# Altium project Motion_Controller.PrjPCB (part 3 of 4)

## Sheet POWER.SchDoc: Power Supply
size 420 x 297 mm; EDA_Number: ARTIQ; Projet: HVPSU_ISOL; Author: G.Kasprowicz; CompanyName: WUT ISE; DrawnBy: G.Kasprowicz; Organization: WUT ISE; Address1: PW ISE; Address2: Nowowiejska 15/19 00-665 Warsaw; Address3: gkasprow@gmail.com; DocumentNumber: 7; Revision: 2; SheetNumber: 7; SheetTotal: 10; ModifiedBy: -; CheckedDate: -; DivGrp: WUT ISE; Designer: G.Kasprowicz; ModifiedDate: -; ProjectName: Sensor Box
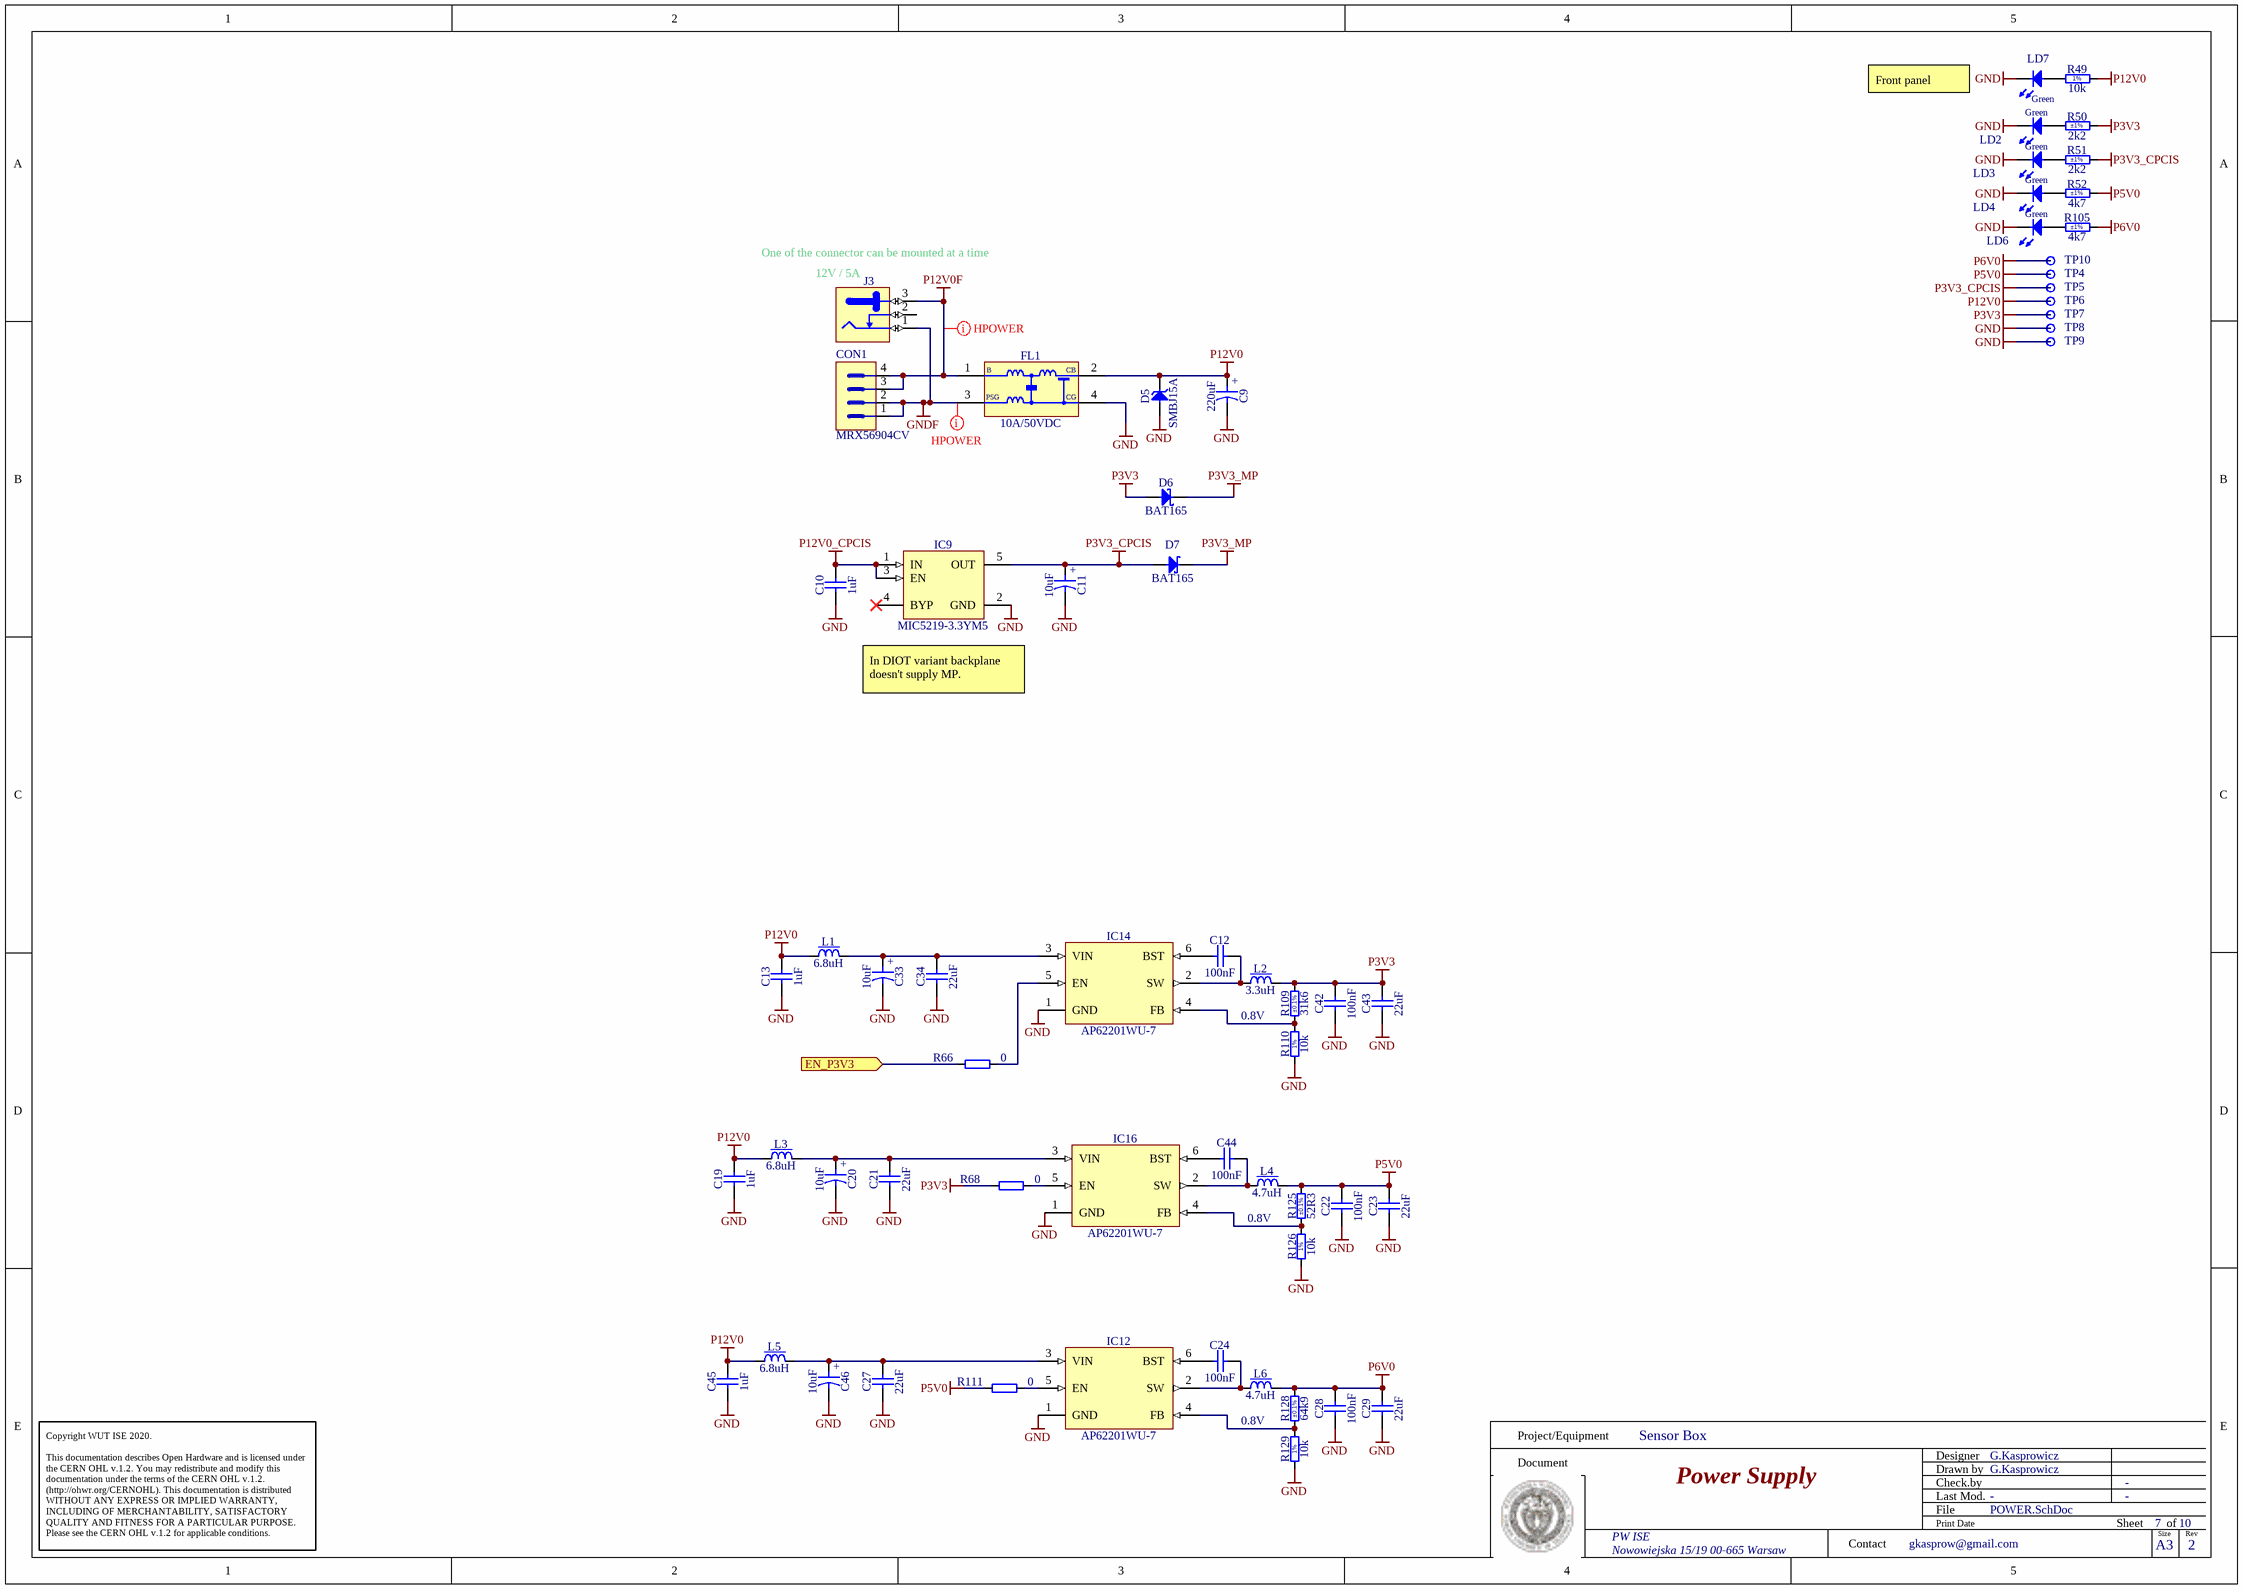
[diagram p6: POWER.SchDoc]

### Parts
C9  220uF  [CAPAE830X620N]
C10  1uF  [CAPC1608X87N]
C11  10uF  [CAPMP3216X180N]
C12  100nF  [CAPC1005X55N]
C13  1uF  [CAPC1608X87N]
C19  1uF  [CAPC1608X87N]
C20  10uF  [CAPMP3216X180N]
C21  22uF  [CAPC2012X135N]
C22  100nF  [CAPC1005X55N]
C23  22uF  [CAPC2012X135N]
C24  100nF  [CAPC1005X55N]
C27  22uF  [CAPC2012X135N]
C28  100nF  [CAPC1005X55N]
C29  22uF  [CAPC2012X135N]
C33  10uF  [CAPMP3216X180N]
C34  22uF  [CAPC2012X135N]
C42  100nF  [CAPC1005X55N]
C43  22uF  [CAPC2012X135N]
C44  100nF  [CAPC1005X55N]
C45  1uF  [CAPC1608X87N]
C46  10uF  [CAPMP3216X180N]
CON1  MRX56904CV  [MRX56904CV]
D5  SMBJ15A  [DIOM5336X265N]
D6  BAT165  [SOD2512X110N]
D7  BAT165  [SOD2512X110N]
FL1  10A/50VDC  [FIL_MURATA_BNX02]
IC9  MIC5219-3.3YM5  [SOT95P280X145-5N]
IC12  AP62201WU-7  [SOT95P280X100-6N]
IC14  AP62201WU-7  [SOT95P280X100-6N]
IC16  AP62201WU-7  [SOT95P280X100-6N]
J3  Jack  [SWITCHCRAFT_L712RA]  (value not drawn)
L1  6.8uH  [IND_COILCRAFT_XAL4030]
L2  3.3uH  [IND_WURTH_WE-TPC_4828]
L3  6.8uH  [IND_COILCRAFT_XAL4030]
L4  4.7uH  [IND_WURTH_WE-SPC-4838]
L5  6.8uH  [IND_COILCRAFT_XAL4030]
L6  4.7uH  [IND_WURTH_WE-SPC-4838]
LD2  Green  [LED_KINGBRIGHT_KPH-1608CGCK]
LD3  Green  [LED_KINGBRIGHT_KPH-1608CGCK]
LD4  Green  [LED_KINGBRIGHT_KPH-1608CGCK]
LD6  Green  [LED_KINGBRIGHT_KPH-1608CGCK]
LD7  Green  [LED_DIALIGHT_555-230]
R49  10k  [RESC1005X40N]
R50  2k2  Tolerance: ±1%  [RESC1005X40N]
R51  2k2  Tolerance: ±1%  [RESC1005X40N]
R52  4k7  Tolerance: ±1%  [RESC1005X40N]
R66  0  [RESC1005X40N]
R68  0  [RESC1005X40N]
R105  4k7  Tolerance: ±1%  [RESC1005X40N]
R109  31k6  Tolerance: ±0.1%  [RESC1005X35N]
R110  10k  [RESC1005X40N]
R111  0  [RESC1005X40N]
R125  52R3  Tolerance: ±0.1%  [RESC1608X55N]
R126  10k  [RESC1005X40N]
R128  64k9  Tolerance: ±0.1%  [RESC1005X40N]
R129  10k  [RESC1005X40N]
TP4  Plated Hole  [c150h100]  (value not drawn)  (no BOM)
TP5  Plated Hole  [c150h100]  (value not drawn)  (no BOM)
TP6  Plated Hole  [c150h100]  (value not drawn)  (no BOM)
TP7  Plated Hole  [c150h100]  (value not drawn)  (no BOM)
TP8  Plated Hole  [c150h100]  (value not drawn)  (no BOM)
TP9  Plated Hole  [c150h100]  (value not drawn)  (no BOM)
TP10  Plated Hole  [c150h100]  (value not drawn)  (no BOM)

### Ports
EN_P3V3 (in)

### Nets
GND: C9.2 C10.1 C11.2 C13.1 C19.1 C20.2 C21.1 C22.1 C23.1 C27.1 C28.1 C29.1 C33.2 C34.1 C42.1 C43.1 C45.1 C46.2 D5.2(A) FL1.4(CG) IC9.2(GND) IC12.1(GND) IC14.1(GND) IC16.1(GND) LD2.1(C) LD3.1(C) LD4.1(C) LD6.1(C) LD7.1(C) R110.1 R126.1 R129.1 TP8.1 TP9.1
GNDF: CON1.1 CON1.2 FL1.3(PSG) J3.1
P3V3: C42.2 C43.2 D6.2(A) L2.2 R50.2 R68.1 R109.2 TP7.1
P3V3_CPCIS: C11.1 D7.2(A) IC9.5(OUT) R51.2 TP5.1
P3V3_MP: D6.1(C) D7.1(C)
P5V0: C22.2 C23.2 L4.2 R52.2 R111.1 R125.2 TP4.1
P6V0: C28.2 C29.2 L6.2 R105.2 R128.2 TP10.1
P12V0: C9.1 C13.2 C19.2 C45.2 D5.1(C) FL1.2(CB) L1.1 L3.1 L5.1 R49.2 TP6.1
P12V0_CPCIS: C10.2 IC9.1(IN) IC9.3(EN)
P12V0F: CON1.3 CON1.4 FL1.1(B) J3.3
EN_P3V3: R66.1 ; port EN_P3V3
NetC12_1: C12.1 IC14.6(BST)
NetC12_2: C12.2 IC14.2(SW) L2.1
NetC20_1: C20.1 C21.2 IC16.3(VIN) L3.2
NetC24_1: C24.1 IC12.6(BST)
NetC24_2: C24.2 IC12.2(SW) L6.1
NetC27_2: C27.2 C46.1 IC12.3(VIN) L5.2
NetC33_1: C33.1 C34.2 IC14.3(VIN) L1.2
NetC44_1: C44.1 IC16.6(BST)
NetC44_2: C44.2 IC16.2(SW) L4.1
NetIC12_4: IC12.4(FB) R128.1 R129.2
NetIC12_5: IC12.5(EN) R111.2
NetIC14_4: IC14.4(FB) R109.1 R110.2
NetIC14_5: IC14.5(EN) R66.2
NetIC16_4: IC16.4(FB) R125.1 R126.2
NetIC16_5: IC16.5(EN) R68.2
NetLD2_2: LD2.2(A) R50.1
NetLD3_2: LD3.2(A) R51.1
NetLD4_2: LD4.2(A) R52.1
NetLD6_2: LD6.2(A) R105.1
NetLD7_2: LD7.2(A) R49.1

Not connected (* = marked no-connect by the designer): IC9 4(BYP)*; J3 2

### Layout directives
net class Hpower; rule Routing Via Style [Pref Size = 0.7mm    Pref Hole Size = 0.5mm]; rule Width Constraint [Pref Width = 20mil    Min Width = 15mil    Max Width = 50mil]: GNDF, P12V0F

### Notes on the sheet
- Front panel
- (near J3) One of the connector can be mounted at a time
- (near J3) 12V / 5A
- In DIOT variant backplane doesn't supply MP.
- 0.8V
- Project/Equipment
- Document
- Designer
- Drawn by
- Check.by
- Copyright WUT ISE 2020.
  This documentation describes Open Hardware and is licensed under the CERN OHL v.1.2. You may redistribute and modify this documentation under the terms of the CERN OHL v.1.2. (http://ohwr.org/CERNOHL). This documentation is distributed WITHOUT ANY EXPRESS OR IMPLIED WARRANTY, INCLUDING OF MERCHANTABILITY, SATISFACTORY QUALITY AND FITNESS FOR A PARTICULAR PURPOSE. Please see the CERN OHL v.1.2 for applicable conditions.
- Contact
- File
- Last Mod.
- Print Date
- Sheet
- Size
- A3
- of
- Rev
- (in symbol CAE830-620_220UF_16V_20%) +
- (in symbol CTE3216-18_10UF_16V_20%_AVX_TCJ) +
- (in symbol R0402_10K_1%_0.0625W_100PPM) 1%

### Library data of the parts
C9 = CAE830-620_220UF_16V_20%: Polarised capacitor; Part Description: Aluminum Electrolytic SMT Capacitor; Manufacturer: PANASONIC; Manufacturer Part Number: EEEFK1C221AP; Voltage: 16V; Tolerance: ±20%; Part Number: CAE830-620_220UF_16V_20%; Component Kind: Standard; Component Type: Standard; Pin Count: 2; Value: 220uF; Status: Not Recommended; Case: E; Mounted: Yes; Socket: No; SMD: Yes; Sense: No; ComponentHeight: 6.2mm; HelpURL: \\cern.ch\dfs\Applications\Altium\Datasheets\CAE_PANASONIC_FK.pdf; Author: CERN DEM JLC; CreateDate: 03.12.2007; LatestRevisionDate: 05.11.2014
C10 C13 C19 C45 = CC0603_1UF_25V_10%_X7R: Non-polarised capacitor; Part Description: SMD Multilayer Chip Ceramic Capacitor; Manufacturer: GENERIC; Manufacturer1 Part Number: GRM188R71E105KA12D; Voltage: 25V; TC: X7R; Tolerance: ±10%; Part Number: CC0603_1UF_25V_10%_X7R; Component Kind: Standard; Component Type: Standard; Pin Count: 2; Value: 1uF; Status: None; Manufacturer Part Number: CC0603_1UF_25V_10%_X7R; Case: 0603; Mounted: Yes; Socket: No; SMD: Yes; Sense: No; Manufacturer1 Example: MURATA; Manufacturer1 ComponentHeight: 0.9mm; HelpURL: \\cern.ch\dfs\Applications\Altium\Datasheets\CC0603_X7R_MURATA.pdf; Author: CERN DEM JLC; CreateDate: 18.01.2011; LatestRevisionDate: 18.01.2011
C11 C20 C33 C46 = CTE3216-18_10UF_16V_20%_AVX_TCJ: Polarised capacitor; Part Description: ESR 0R200 Tantalum Solid Electrolytic Chip Capacitor with Conductive Polymer Electrode; Manufacturer: AVX; Manufacturer Part Number: TCJA106M016R0200 or  or TR3A106K016C1700; Voltage: 16V; Tolerance: ±20%; Part Number: CTE3216-18_10UF_16V_20%_AVX_TCJ; Component Kind: Standard; Component Type: Standard; Pin Count: 2; Value: 10uF; Status: Preferred; Case: A; Mounted: Yes; Socket: No; SMD: Yes; Sense: No; ComponentHeight: 1.8mm; HelpURL: \\cern.ch\dfs\Applications\Altium\Datasheets\CTE_AVX_TCJ.pdf; Author: CERN DEM JLC; CreateDate: 29.03.2012; LatestRevisionDate: 29.03.2012
C12 C22 C24 C28 C42 C44 = CC0402_100NF_16V_10%_X5R: as C37 on sheet DAC_TLV5637; Part Number: CC0402_100NF_16V_10%_X5R; Component Kind: Standard; Component Type: Standard; Pin Count: 2; Value: 100nF; Status: None; Manufacturer Part Number: CC0402_100NF_16V_10%_X5R; Case: 0402; Mounted: Yes; Socket: No; SMD: Yes; Sense: No; Manufacturer1 Example: MURATA; Manufacturer1 ComponentHeight: 0.55mm; HelpURL: \\cern.ch\dfs\Applications\Altium\Datasheets\CC0402_X5R_MURATA_GRM.pdf; Author: CERN DEM JLC; CreateDate: 10.12.2013; LatestRevisionDate: 10.12.2013
C21 C23 C27 C29 C34 C43 = CC0805_22UF_16V_10%_X5R: Non-polarised capacitor; Part Description: SMD Multilayer Chip Ceramic Capacitor; Manufacturer: GENERIC; Manufacturer1 Part Number: C2012X5R1C226KT; Voltage: 16V; TC: X5R; Tolerance: ±10%; Part Number: CC0805_22UF_16V_10%_X5R; Component Kind: Standard; Component Type: Standard; Pin Count: 2; Value: 22uF; Status: Preferred; Manufacturer Part Number: CC0805_22UF_16V_10%_X5R; Case: 0805; Mounted: Yes; Socket: No; SMD: Yes; Sense: No; Manufacturer1 Example: TDK; Manufacturer1 ComponentHeight: 1.35mm; HelpURL: \\cern.ch\dfs\Applications\Altium\Datasheets\CC0805_X5R_TDK_C.pdf; Author: CERN DEM JLC; CreateDate: 25.10.2012; LatestRevisionDate: 25.10.2012
CON1 = CON_CRIMP_4.2mm_RA_4: 4.2mm cripm terminal header
D5 = SMBJ15A: Zener Diode; Part Description: Uni-Directional Transient Voltage Suppressor Diode; Manufacturer: FAIRCHILD SEMICONDUCTOR; Voltage: 15V; Power: 600W; PressFit: No; Bonding: No; Part Number: SMBJ15A; Component Kind: Standard; Component Type: Standard; Device: SMBJ15A; PackageDescription: DO-214-AA/SMB Diode, Molded Body; 5.34mm L X 3.625mm W X 2.65mm H, IPC Medium Density; Manufacturer Part Number: SMBJ15A; Pin Count: 2; Case: DO-214AA; Mounted: Yes; Socket: No; SMD: Yes; Sense: No; ComponentHeight: 2.65mm; HelpURL: \\cern.ch\dfs\Applications\Altium\Datasheets\SMBJ.pdf; Author: CERN DEM JLC; CreateDate: 08.12.2008; LatestRevisionDate: 19.12.2011
D6 = BAT165: Schottky Diode; Part Description: Medium Power AF Schottky Diode; Manufacturer: INFINEON; Voltage: 40V; Power: 750mA; PressFit: No; Bonding: No; Part Number: BAT165; Component Kind: Standard; Component Type: Standard; Device: BAT165; PackageDescription: Small Outline Diode (SOD-323), 1.70mm W X 1.25mm L X 1.10mm H body,  IPC Medium Density; Manufacturer Part Number: BAT165; Pin Count: 2; Case: SOD-323; Mounted: Yes; Socket: No; SMD: Yes; Sense: No; ComponentHeight: 1.1mm; HelpURL: \\cern.ch\dfs\Applications\Altium\Datasheets\BAT165.pdf; Author: CERN DEM JLC; CreateDate: 12.11.2014; LatestRevisionDate: 12.11.2014
D7 = BAT165: Schottky Diode; Manufacturer: INFINEON; Part Description: Medium Power AF Schottky Diode; Voltage: 40V; Power: 750mA; PressFit: No; Bonding: No; Manufacturer Part Number: BAT165; PackageDescription: Small Outline Diode (SOD-323), 1.70mm W X 1.25mm L X 1.10mm H body,  IPC Medium Density; Part Number: BAT165; Component Kind: Standard; Component Type: Standard; Device: BAT165; Pin Count: 2; Case: SOD323; Mounted: Yes; Socket: No; SMD: Yes; Sense: No; ComponentHeight: 1.1mm; HelpURL: \\cern.ch\dfs\Applications\Altium\Datasheets\BAT165.pdf; Author: CERN DEM JLC; CreateDate: 12.11.2014; LatestRevisionDate: 12.11.2014
FL1 = FIL_MURATA_BNX022-01L: Block Type EMIFIL (LC Combined); Part Description: Block Type EMIFIL (LC Combined) SMD Type, BNX02* Series; Manufacturer: MURATA; Resistance: 0.5R; Part Number: FIL_MURATA_BNX022-01L; Component Kind: Standard; Component Type: Standard; Pin Count: 2; Value: 10A/50VDC; Status: None; Manufacturer Part Number: BNX022-01L; Mounted: Yes; Socket: No; SMD: Yes; Sense: No; ComponentHeight: 3.3mm; HelpURL: \\cern.ch\dfs\Applications\Altium\Datasheets\FIL_MURATA_BNX022-01L.pdf; Author: CERN DEM JLC; CreateDate: 10.10.2012; LatestRevisionDate: 10.10.2012
IC9 = MIC5219-3.3YM5: 500mA Peak Output LDO Regulator; Part Description: 3.3V 500mA Peak Output Low Drop-Out  (LDO) Regulator; Manufacturer: MICROCHIP TECHNOLOGY; PressFit: No; Bonding: No; Part Number: MIC5219-3.3YM5; Component Kind: Standard; Component Type: Standard; Device: MIC5219-3.3YM5; PackageDescription: SOT, 0.95mm pitch; 5 pin, 1.60mm W X 2.90mm L X 1.45mm H body, IPC Medium Density; Manufacturer Part Number: MIC5219-3.3YM5; Pin Count: 5; Case: SOT23-5; Mounted: Yes; Socket: No; SMD: Yes; Sense: No; ComponentHeight: 1.45mm; HelpURL: \\cern.ch\dfs\Applications\Altium\Datasheets\MIC5219-3.3YM5.pdf; Author: CERN DEM WB; CreateDate: 2019-04-16; LatestRevisionDate: 2019-04-16
IC12 IC14 IC16 = AP62201WU-7: 4.2V TO 18V INPUT, 2A LOW IQ SYNCHRONOUS BUCK CONVERTER; Manufacturer: DIODES INCORPORATED; PressFit: No; Bonding: No; Part Number: AP62201WU-7; Component Kind: Standard; Component Type: Standard; Device: AP62201WU-7; PackageDescription: SOT23, 0.95mm Pitch; 6 Pin, 1.625mm W X 2.90mm L X 1.00mm H body, IPC Medium Density; Part Description: 4.2V TO 18V INPUT, 2A LOW IQ SYNCHRONOUS BUCK CONVERTER; Manufacturer Part Number: AP62201WU-7; Pin Count: 6; Case: SOT23-6; Mounted: Yes; Socket: No; SMD: Yes; Sense: No; ComponentHeight: 1.1mm; HelpURL: \\cern.ch\dfs\Applications\Altium\Datasheets\AP6220x.pdf; Author: CERN DEM HF; CreateDate: 07.01.2022; LatestRevisionDate: 07.01.2022
J3 = CON_DC_5A_THT_RA: 24V /3. 5A, 2.1mm Diameter Pin, SMD DC Power Supply Connector With  Break Contact; Part Description: 12V/5A, 2.5mm Diameter Pin, THT DC Power Supply Connector With  Break Contact; Manufacturer: SWITCHCRAFT; Manufacturer Part Number: L712RA; PressFit: No; Part Number: SWITCHCRAFT_L712RA; Component Kind: Standard; Component Type: Standard; Pin Count: 3; Family: Jack; Mounted: Yes; Socket: No; SMD: No; Sense: No; Status: None; ComponentHeight: 11mm; HelpURL: \\cern.ch\dfs\Applications\Altium\Datasheets\LUMBERG_161314.pdf; Author: GK; CreateDate: 15.02.2011; LatestRevisionDate: 20.07.2011
L1 L3 L5 = IND_6.8UH_20%_COILCRAFT_XAL4030: Inductor With Core; Part Description: SMD Shielded Power Inductor; Manufacturer Part Number: XAL4030-682MEB; Power: 3A; Resistance: 0.0741R; Tolerance: ±20%; Part Number: IND_6.8UH_20%_COILCRAFT_XAL4030; Component Kind: Standard; Component Type: Standard; Pin Count: 2; Value: 6.8uH; Status: None; Manufacturer: COILCRAFT; Mounted: Yes; Socket: No; SMD: Yes; Sense: No; ComponentHeight: 2.1mm; HelpURL: \\cern.ch\dfs\Applications\Altium\Datasheets\IND_COILCRAFT_XAL4030.pdf; Author: CERN DEM MR; CreateDate: 14.03.2016; LatestRevisionDate: 14.03.2016
L2 = IND_3.3UH_30%_WURTH_WE-TPC_744043003: Inductor With Core; Part Description: Shielded Tiny Power Inductor (WE-TPC Serie); Manufacturer: WURTH ELEKTRONIK; Power: 2.15A; Resistance: 0.03R; Tolerance: ±30%; Part Number: IND_3.3UH_30%_WURTH_WE-TPC_744043003; Component Kind: Standard; Component Type: Standard; Pin Count: 2; Value: 3.3uH; Manufacturer Part Number: 744043003; Mounted: Yes; Socket: No; SMD: Yes; Sense: No; ComponentHeight: 3mm; HelpURL: \\cern.ch\dfs\Applications\Altium\Datasheets\IND_WURTH_WE-TPC_744043003.pdf; Author: CERN DEM JLC; CreateDate: 12.07.2011; LatestRevisionDate: 24.01.2012
L4 L6 = IND_4.7UH_20%_WURTH_WE-SPC_74408943047: Inductor With Core; Part Description: SMD Shielded Power Inductor (WE-SPC Series); Manufacturer: WURTH ELEKTRONIK; Power: 2.2A; Resistance: 0.045R; Tolerance: ±20%; Part Number: IND_4.7UH_20%_WURTH_WE-SPC_74408943047; Component Kind: Standard; Component Type: Standard; Pin Count: 2; Value: 4.7uH; Manufacturer Part Number: 74408943047; Mounted: Yes; Socket: No; SMD: Yes; Sense: No; ComponentHeight: 4.1mm; HelpURL: \\cern.ch\dfs\Applications\Altium\Datasheets\IND_WURTH_WE-SPC_74408943047.pdf; Author: CERN DEM JLC; CreateDate: 24/11/2014; LatestRevisionDate: 05/07/2017
LD2-LD4 LD6 = LED_KINGBRIGHT_KPH-1608CGCK: LED Green 1C 2A; Part Description: SMD Green LED, Case 1.6mmX0.8mm(0603), 0.65mm Thickness; PressFit: No; Bonding: No; Part Number: LED_KINGBRIGHT_KPH-1608CGCK; Component Kind: Standard; Component Type: Standard; Color: Green; PackageDescription: SMT Green LED, Case 0603, Body L 1.6 x W 0.8mm H 0.65mm; Manufacturer: KINGBRIGHT; Manufacturer Part Number: KPH-1608CGCK; Pin Count: 2; Mounted: Yes; Socket: No; SMD: Yes; Sense: No; ComponentHeight: 0.65mm; HelpURL: \\cern.ch\dfs\Applications\Altium\Datasheets\LED_KINGBRIGHT_KPH-1608CGCK.pdf; Author: CERN DEM JLC; CreateDate: 03/07/2017; LatestRevisionDate: 03/07/2017
LD7 = LED_DIALIGHT_555-2301F: LED Green 1C 2A; Part Description: Single 2mm Green LED CBI® Circuit Board Indicator; PressFit: No; Bonding: No; Part Number: LED_DIALIGHT_555-2301F; Component Kind: Standard; Component Type: Standard; Color: Green; PackageDescription: Single 2mm Green LED, Body 5.08x2.54mm, Pin spacing 2.54mm; Manufacturer: DIALIGHT; Manufacturer Part Number: 555-2301F; Pin Count: 2; Mounted: Yes; Socket: No; SMD: No; Sense: No; ComponentHeight: 6.35mm; HelpURL: \\cern.ch\dfs\Applications\Altium\Datasheets\LED_DIALIGHT_555-2301F.pdf; Author: CERN DEM JMW; CreateDate: 22.09.2008; LatestRevisionDate: 17.03.2010
R49 = R0402_10K_1%_0.0625W_100PPM: as R115 on sheet TOP; Part Number: R0402_10K_1%_0.0625W_100PPM; Component Kind: Standard; Component Type: Standard; Pin Count: 2; Value: 10k; Status: Not Recommended; Power: 0.0625W; Tolerance: ±1%; Manufacturer Part Number: R0402_10K_1%_0.0625W_100PPM; Case: 0402; Mounted: Yes; Sense: No; Socket: No; SMD: Yes; Manufacturer1 Example: YAGEO PHYCOMP; Manufacturer1 ComponentHeight: 0.4mm; HelpURL: \\cern.ch\dfs\Applications\Altium\Datasheets\R0402_Phycomp_RC0402.pdf; Author: CERN DEM JLC; CreateDate: 03.12.2007; LatestRevisionDate: 17.10.2012
R50 R51 = R0402_2K2_1%_0.0625W_100PPM: Resistor - 1%; Part Description: General Purpose Thick Film Chip Resistor; Manufacturer: GENERIC; Manufacturer1 Part Number: 232270672202L; TC: ±100ppm/°C; PressFit: No; Part Number: R0402_2K2_1%_0.0625W_100PPM; Component Kind: Standard; Component Type: Standard; Pin Count: 2; Value: 2k2; Status: Not Recommended; Power: 0.0625W; Manufacturer Part Number: R0402_2K2_1%_0.0625W_100PPM; Case: 0402; Mounted: Yes; Sense: No; Socket: No; SMD: Yes; Manufacturer1 Example: YAGEO PHYCOMP; Manufacturer1 ComponentHeight: 0.4mm; HelpURL: \\cern.ch\dfs\Applications\Altium\Datasheets\R0402_Phycomp_RC0402.pdf; Author: CERN DEM JLC; CreateDate: 03.12.2007; LatestRevisionDate: 17.10.2012
R52 R105 = R0402_4K7_1%_0.0625W_100PPM: Resistor - 1%; Part Description: General Purpose Thick Film Chip Resistor; Manufacturer: GENERIC; Manufacturer1 Part Number: 232270674702L; TC: ±100ppm/°C; PressFit: No; Part Number: R0402_4K7_1%_0.0625W_100PPM; Component Kind: Standard; Component Type: Standard; Pin Count: 2; Value: 4k7; Status: Not Recommended; Power: 0.0625W; Manufacturer Part Number: R0402_4K7_1%_0.0625W_100PPM; Case: 0402; Mounted: Yes; Sense: No; Socket: No; SMD: Yes; Manufacturer1 Example: YAGEO PHYCOMP; Manufacturer1 ComponentHeight: 0.4mm; HelpURL: \\cern.ch\dfs\Applications\Altium\Datasheets\R0402_Phycomp_RC0402.pdf; Author: CERN DEM JLC; CreateDate: 03/12/2007; LatestRevisionDate: 17/10/2012
R66 R68 R111 = R0402_0R_JUMPER: Resistor; Part Description: 1A (0.05R Max DC Resistance) Zero Ohm Jumper; Manufacturer: GENERIC; Manufacturer1 Part Number: 232270591001L; PressFit: No; Part Number: R0402_0R_JUMPER; Component Kind: Standard; Component Type: Standard; Pin Count: 2; Value: 0; Status: Not Recommended; Manufacturer Part Number: R0402_0R_JUMPER; Case: 0402; Mounted: Yes; Sense: No; Socket: No; SMD: Yes; Manufacturer1 Example: YAGEO PHYCOMP; Manufacturer1 ComponentHeight: 0.4mm; HelpURL: \\cern.ch\dfs\Applications\Altium\Datasheets\R0402_Phycomp_RC0402.pdf; Author: CERN DEM JLC; CreateDate: 03.12.2007; LatestRevisionDate: 17.10.2012
R109 = R0402_31K6_0.1%_0.063W_25PPM_YAGEO_RT: Resistor - 0.1%; Part Description: Thin Film Chip Resistor; Manufacturer: YAGEO; Manufacturer Part Number: RT0402BRD0731K6L; Power: 0.063W; TC: ±25ppm/°C; Voltage: 50V; PressFit: No; Part Number: R0402_31K6_0.1%_0.063W_25PPM_YAGEO_RT; Component Kind: Standard; Component Type: Standard; Pin Count: 2; Value: 31k6; Status: Not Recommended; Case: 0402; Mounted: Yes; Sense: No; Socket: No; SMD: Yes; ComponentHeight: 0.35mm; HelpURL: \\cern.ch\dfs\Applications\Altium\Datasheets\R0402_YAGEO_RT.pdf; Author: CERN DEM BC; CreateDate: 30.07.2020; LatestRevisionDate: 30.07.2020
R110 R126 R129 = R0402_10K_1%_0.0625W_100PPM: Resistor - 1%; Part Description: General Purpose Thick Film Chip Resistor; Manufacturer: GENERIC; Manufacturer1 Part Number: 232270671003L; TC: ±100ppm/°C; Part Number: R0402_10K_1%_0.0625W_100PPM; Component Kind: Standard; Component Type: Standard; Pin Count: 2; Value: 10k; Status: Not recommended; Power: 0.0625W; Tolerance: ±1%; Manufacturer Part Number: R0402_10K_1%_0.0625W_100PPM; Case: 0402; Mounted: Yes; Sense: No; Socket: No; SMD: Yes; Manufacturer1 Example: YAGEO PHYCOMP; Manufacturer1 ComponentHeight: 0.4mm; HelpURL: \\cern.ch\dfs\Applications\Altium\Datasheets\R0402_Phycomp_RC0402.pdf; Author: CERN DEM JLC; CreateDate: 03.12.2007; LatestRevisionDate: 17.10.2012
R125 = R0603_52R3_0.1%_0.063W_10PPM: Resistor - 0.1%; Part Description: Thin Film Chip Resistor; Manufacturer: GENERIC; Manufacturer1 Part Number: RN73C1J52R3BTG; Power: 0.063W; TC: ±10ppm; PressFit: No; Part Number: R0603_52R3_0.1%_0.063W_10PPM; Component Kind: Standard; Component Type: Standard; Pin Count: 2; Value: 52R3; Status: Not Recommended; Manufacturer Part Number: R0603_52R3_0.1%_0.063W_10PPM; Case: 0603; Mounted: Yes; Sense: No; Socket: No; SMD: Yes; HelpURL: \\cern.ch\dfs\Applications\Altium\Datasheets\R0603_Tyco_RN73.pdf; Author: CERN DEM JLC; CreateDate: 16/03/2011; LatestRevisionDate: 16/03/2011; Manufacturer1 Example: TYCO HOLSWORTHY; Manufacturer1 ComponentHeight: 0.5mm
R128 = R0402_64K9_0.1%_0.063W_25PPM: Resistor - 0.1%; Part Description: General Purpose Thick Film Chip Resistor; Manufacturer: GENERIC; Manufacturer1 Part Number: RP73PF1E64K9B; Power: 0.063W; TC: ±25ppm/°C; PressFit: No; Part Number: R0402_64K9_0.1%_0.063W_25PPM; Component Kind: Standard; Component Type: Standard; Pin Count: 2; Value: 64k9; Status: None; Manufacturer Part Number: R0402_64K9_0.1%_0.063W_25PPM; Case: 0402; Mounted: Yes; Sense: No; Socket: No; SMD: Yes; HelpURL: \\cern.ch\dfs\Applications\Altium\Datasheets\R0402_TYCO_RP73.pdf; Author: CERN DEM HF; CreateDate: 01/12/2022; LatestRevisionDate: 01/12/2022; Manufacturer1 Example: VISHAY; Manufacturer1 ComponentHeight: 0.4mm
TP4-TP10 = PLATED_HOLE1.0_PAD1.5: Single Terminal Socket; Part Description: Plated Through Hole: Hole Dia.=1mm Pad Dia.=1.5mm,  IPC-7251 Level C; Mounted: No; Part Number: PLATED_HOLE1.0_PAD1.5; Component Type: Standard (No BOM); Pin Count: 1; Family: Plated Hole; Socket: No; SMD: No; Sense: No; Status: None; ComponentHeight: 0mm; HelpURL: Undefined; Author: CERN DEM JLC; CreateDate: 30/10/2008; LatestRevisionDate: 30/10/2008; PackageDescription: Plated Through Hole: Hole Dia.=1mm Pad Dia.=1.5mm,  IPC-7251 Level C

## Sheet RJ45.SchDoc
size 420 x 297 mm; Author: P. Zdunek; CompanyName: WUT ISE; DrawnBy: P. Zdunek; Organization: WUT ISE; Address1: PW ISE; Address2: Nowowiejska 15/19 00-665 Warsaw; Address3: p.zdunek90@gmail.com; DocumentNumber: 9; Revision: 2; SheetNumber: 9; SheetTotal: 10; ModifiedBy: -; CheckedDate: -; Title2: Stage; DivGrp: WUT ISE; Designer: P. Zdunek; ModifiedDate: -; ProjectName: Sensor Box
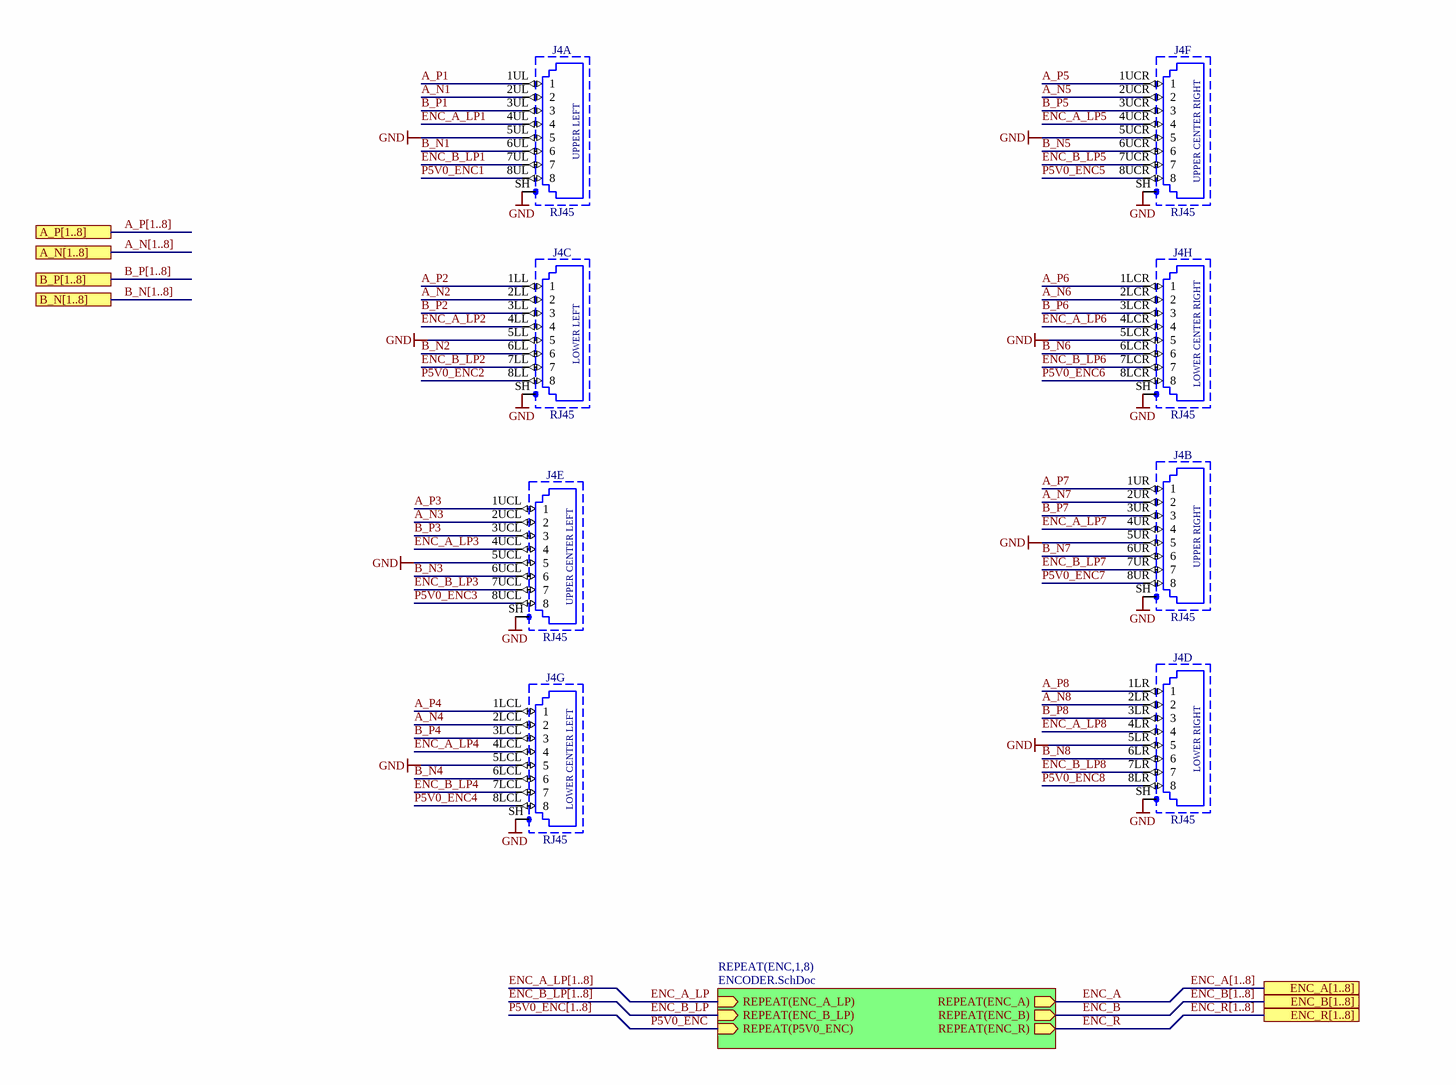
[diagram p7: RJ45.SchDoc, left]
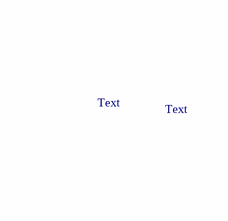
[diagram p8: RJ45.SchDoc, right]

### Parts
J4  RJ45  [TYCO_5569262-1]  (parts A,B,C,D,E,F,G,H of 8)

### Sub-sheets
REPEAT(ENC,1,8) = ENCODER.SchDoc: REPEAT(ENC_R) (out), REPEAT(ENC_B) (out), REPEAT(ENC_A) (out), REPEAT(ENC_B_LP) (in), REPEAT(ENC_A_LP) (in), REPEAT(P5V0_ENC) (in)

### Ports
A_N[1..8], A_P[1..8], B_N[1..8], B_P[1..8], ENC_A[1..8], ENC_B[1..8], ENC_R[1..8]

### Nets
GND: J4.5LCL(5) J4.5LCR(5) J4.5LL(5) J4.5LR(5) J4.5UCL(5) J4.5UCR(5) J4.5UL(5) J4.5UR(5) J4.SH
A_N1: J4.2UL(2)  [project net I_OUT_A_N1]
A_N2: J4.2LL(2)  [project net I_OUT_A_N2]
A_N3: J4.2UCL(2)  [project net I_OUT_A_N3]
A_N4: J4.2LCL(2)  [project net I_OUT_A_N4]
A_N5: J4.2UCR(2)  [project net I_OUT_A_N5]
A_N6: J4.2LCR(2)  [project net I_OUT_A_N6]
A_N7: J4.2UR(2)  [project net I_OUT_A_N7]
A_N8: J4.2LR(2)  [project net I_OUT_A_N8]
A_P1: J4.1UL(1)  [project net I_OUT_A_P1]
A_P2: J4.1LL(1)  [project net I_OUT_A_P2]
A_P3: J4.1UCL(1)  [project net I_OUT_A_P3]
A_P4: J4.1LCL(1)  [project net I_OUT_A_P4]
A_P5: J4.1UCR(1)  [project net I_OUT_A_P5]
A_P6: J4.1LCR(1)  [project net I_OUT_A_P6]
A_P7: J4.1UR(1)  [project net I_OUT_A_P7]
A_P8: J4.1LR(1)  [project net I_OUT_A_P8]
B_N1: J4.6UL(6)  [project net I_OUT_B_N1]
B_N2: J4.6LL(6)  [project net I_OUT_B_N2]
B_N3: J4.6UCL(6)  [project net I_OUT_B_N3]
B_N4: J4.6LCL(6)  [project net I_OUT_B_N4]
B_N5: J4.6UCR(6)  [project net I_OUT_B_N5]
B_N6: J4.6LCR(6)  [project net I_OUT_B_N6]
B_N7: J4.6UR(6)  [project net I_OUT_B_N7]
B_N8: J4.6LR(6)  [project net I_OUT_B_N8]
B_P1: J4.3UL(3)  [project net I_OUT_B_P1]
B_P2: J4.3LL(3)  [project net I_OUT_B_P2]
B_P3: J4.3UCL(3)  [project net I_OUT_B_P3]
B_P4: J4.3LCL(3)  [project net I_OUT_B_P4]
B_P5: J4.3UCR(3)  [project net I_OUT_B_P5]
B_P6: J4.3LCR(3)  [project net I_OUT_B_P6]
B_P7: J4.3UR(3)  [project net I_OUT_B_P7]
B_P8: J4.3LR(3)  [project net I_OUT_B_P8]
ENC_A: sheet REPEAT(ENC,1,8)/REPEAT(ENC_A)
ENC_A_LP: sheet REPEAT(ENC,1,8)/REPEAT(ENC_A_LP)
ENC_A_LP1: J4.4UL(4)
ENC_A_LP2: J4.4LL(4)
ENC_A_LP3: J4.4UCL(4)
ENC_A_LP4: J4.4LCL(4)
ENC_A_LP5: J4.4UCR(4)
ENC_A_LP6: J4.4LCR(4)
ENC_A_LP7: J4.4UR(4)
ENC_A_LP8: J4.4LR(4)
ENC_B: sheet REPEAT(ENC,1,8)/REPEAT(ENC_B)
ENC_B_LP: sheet REPEAT(ENC,1,8)/REPEAT(ENC_B_LP)
ENC_B_LP1: J4.7UL(7)
ENC_B_LP2: J4.7LL(7)
ENC_B_LP3: J4.7UCL(7)
ENC_B_LP4: J4.7LCL(7)
ENC_B_LP5: J4.7UCR(7)
ENC_B_LP6: J4.7LCR(7)
ENC_B_LP7: J4.7UR(7)
ENC_B_LP8: J4.7LR(7)
ENC_R: sheet REPEAT(ENC,1,8)/REPEAT(ENC_R)
P5V0_ENC: sheet REPEAT(ENC,1,8)/REPEAT(P5V0_ENC)
P5V0_ENC1: J4.8UL(8)
P5V0_ENC2: J4.8LL(8)
P5V0_ENC3: J4.8UCL(8)
P5V0_ENC4: J4.8LCL(8)
P5V0_ENC5: J4.8UCR(8)
P5V0_ENC6: J4.8LCR(8)
P5V0_ENC7: J4.8UR(8)
P5V0_ENC8: J4.8LR(8)

### Buses and harness runs
bus A_N[1..8] = port A_N[1..8]
bus A_P[1..8] = port A_P[1..8]
bus B_N[1..8] = port B_N[1..8]
bus B_P[1..8] = port B_P[1..8]
bus ENC_A[1..8] = port ENC_A[1..8]
bus ENC_A_LP[1..8]
bus ENC_B[1..8] = port ENC_B[1..8]
bus ENC_B_LP[1..8]
bus ENC_R[1..8] = port ENC_R[1..8]
bus P5V0_ENC[1..8]

### Notes on the sheet
- Text
- Project/Equipment
- Document
- Designer
- Drawn by
- Check.by
- Copyright WUT ISE 2020.
  This documentation describes Open Hardware and is licensed under the CERN OHL v.1.2. You may redistribute and modify this documentation under the terms of the CERN OHL v.1.2. (http://ohwr.org/CERNOHL). This documentation is distributed WITHOUT ANY EXPRESS OR IMPLIED WARRANTY, INCLUDING OF MERCHANTABILITY, SATISFACTORY QUALITY AND FITNESS FOR A PARTICULAR PURPOSE. Please see the CERN OHL v.1.2 for applicable conditions.
- Contact
- File
- Last Mod.
- Print Date
- Sheet
- Size
- A3
- of
- Rev
- (in symbol TYCO_5569262-1, part A) UPPER LEFT
- (in symbol TYCO_5569262-1, part B) UPPER RIGHT
- (in symbol TYCO_5569262-1, part C) LOWER LEFT
- (in symbol TYCO_5569262-1, part D) LOWER RIGHT
- (in symbol TYCO_5569262-1, part E) UPPER CENTER LEFT
- (in symbol TYCO_5569262-1, part F) UPPER CENTER RIGHT
- (in symbol TYCO_5569262-1, part G) LOWER CENTER LEFT
- (in symbol TYCO_5569262-1, part H) LOWER CENTER RIGHT

### Library data of the parts
J4 = TYCO_5569262-1: Connector 2 x 4 RJ45 + Shield; Part Description: 2 x 4 Port, 8 Positions Stacked RJ45 Jack, with Panel And PCB Ground Tabs, Category 5; Manufacturer: TYCO ELECTRONICS; PressFit: No; Part Number: TYCO_5569262-1; Component Kind: Standard; Component Type: Standard; Pin Count: 65; Family: RJ45; Mounted: Yes; Socket: No; SMD: No; Sense: No; Status: None; Manufacturer Part Number: 5569262-1; ComponentHeight: 26.29mm; HelpURL: \\cern.ch\dfs\Applications\Altium\Datasheets\TYCO_5569262-1.pdf; Author: CERN DEM MR; CreateDate: 12/01/2016; LatestRevisionDate: 12/01/2016

## Sheet ENCODER.SchDoc: Encoder
size 420 x 297 mm; Author: P. Zdunek; CompanyName: WUT ISE; DrawnBy: P. Zdunek; Organization: WUT ISE; Address1: PW ISE; Address2: Nowowiejska 15/19 00-665 Warsaw; Address3: p.zdunek90@gmail.com; DocumentNumber: 10; Revision: 2; SheetNumber: 10; SheetTotal: 10; ModifiedBy: -; CheckedDate: -; DivGrp: WUT ISE; Designer: P. Zdunek; ModifiedDate: -; ProjectName: Sensor Box
Used 8 times, as channels U_RJ45/ENC1, U_RJ45/ENC2, U_RJ45/ENC3, U_RJ45/ENC4, U_RJ45/ENC5, U_RJ45/ENC6, U_RJ45/ENC7, U_RJ45/ENC8. Parts and nets are listed once, with the designators drawn on the sheet.
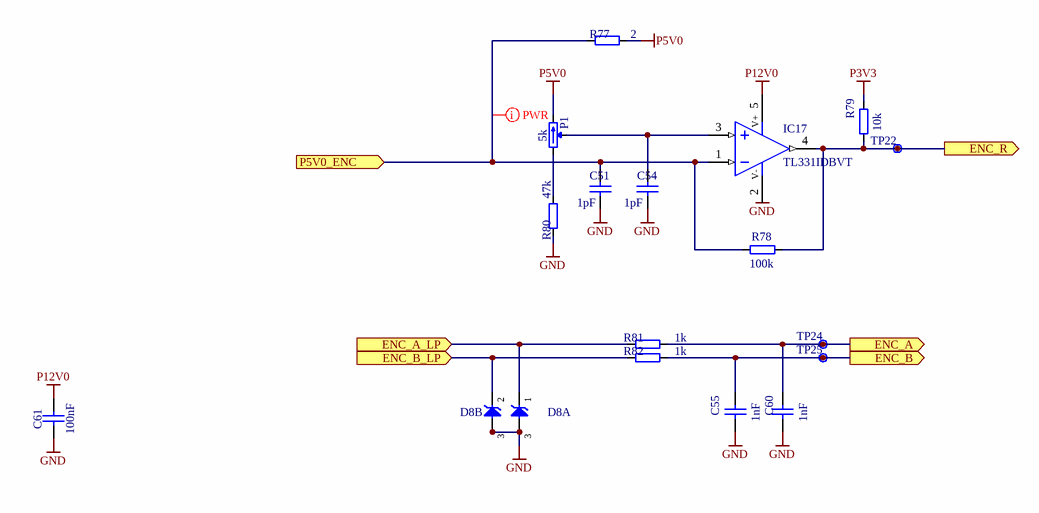
[diagram p9: ENCODER.SchDoc]

### Parts
C51  1pF  [CAPC1005X55N]
C54  1pF  [CAPC1005X55N]
C55  1nF  [CAPC1005X55N]
C60  1nF  [CAPC1005X55N]
C61  100nF  [CAPC1005X55N]
D8  ESD5V3U2U-03F  [SOTFL40P120X59-3N]  (value not drawn)  (parts A,B of 2)
IC17  TL331IDBVT  [SOT95P280X145-5N]
P1  5k  [TRIM_BOURNS_3314G-1]
R77  2  [RESC3216X65N]
R78  100k  [RESC1608X55N]
R79  10k  [RESC1005X40N]
R80  47k  [RESC1608X55N]
R81  1k  [RESC1005X40N]
R82  1k  [RESC1005X40N]
TP22  Plated Hole  [c130h60]  (value not drawn)  (no BOM)
TP24  Plated Hole  [c130h60]  (value not drawn)  (no BOM)
TP25  Plated Hole  [c130h60]  (value not drawn)  (no BOM)

### Ports
ENC_A (out), ENC_A_LP (in), ENC_B (out), ENC_B_LP (in), ENC_R (out), P5V0_ENC (in)

### Nets
GND: C51.1 C54.1 C55.1 C60.1 C61.1 D8.3(COMA) R80.1
P3V3: R79.2
P5V0: P1.3(CW) R77.1
P12V0: C61.2 IC17.5(VS)
ENC_A: C60.2 R81.1 TP24.1 ; port ENC_A
ENC_A_LP: D8.1(C) R81.2 ; port ENC_A_LP
ENC_B: C55.2 R82.1 TP25.1 ; port ENC_B
ENC_B_LP: D8.2(C) R82.2 ; port ENC_B_LP
ENC_R: IC17.4(OUT) R78.1 R79.1 TP22.1 ; port ENC_R
P5V0_ENC: C51.2 IC17.1(IN-) R77.2 R78.2 ; port P5V0_ENC
NetC54_2: C54.2 IC17.3(IN+) P1.2(W)
NetP1_1: P1.1(CCW) R80.2

Not connected (* = marked no-connect by the designer): IC17 2(GND)

### Channels
U_RJ45/ENC1: designators end in A; ports ENC_A=ENC_A1 ENC_A_LP=ENC_A_LP1 ENC_B=ENC_B1 ENC_B_LP=ENC_B_LP1 ENC_R=ENC_R1 P5V0_ENC=P5V0_ENC1
U_RJ45/ENC2: designators end in B; ports ENC_A=ENC_A2 ENC_A_LP=ENC_A_LP2 ENC_B=ENC_B2 ENC_B_LP=ENC_B_LP2 ENC_R=ENC_R2 P5V0_ENC=P5V0_ENC2
U_RJ45/ENC3: designators end in C; ports ENC_A=ENC_A3 ENC_A_LP=ENC_A_LP3 ENC_B=ENC_B3 ENC_B_LP=ENC_B_LP3 ENC_R=ENC_R3 P5V0_ENC=P5V0_ENC3
U_RJ45/ENC4: designators end in D; ports ENC_A=ENC_A4 ENC_A_LP=ENC_A_LP4 ENC_B=ENC_B4 ENC_B_LP=ENC_B_LP4 ENC_R=ENC_R4 P5V0_ENC=P5V0_ENC4
U_RJ45/ENC5: designators end in E; ports ENC_A=ENC_A5 ENC_A_LP=ENC_A_LP5 ENC_B=ENC_B5 ENC_B_LP=ENC_B_LP5 ENC_R=ENC_R5 P5V0_ENC=P5V0_ENC5
U_RJ45/ENC6: designators end in F; ports ENC_A=ENC_A6 ENC_A_LP=ENC_A_LP6 ENC_B=ENC_B6 ENC_B_LP=ENC_B_LP6 ENC_R=ENC_R6 P5V0_ENC=P5V0_ENC6
U_RJ45/ENC7: designators end in G; ports ENC_A=ENC_A7 ENC_A_LP=ENC_A_LP7 ENC_B=ENC_B7 ENC_B_LP=ENC_B_LP7 ENC_R=ENC_R7 P5V0_ENC=P5V0_ENC7
U_RJ45/ENC8: designators end in H; ports ENC_A=ENC_A8 ENC_A_LP=ENC_A_LP8 ENC_B=ENC_B8 ENC_B_LP=ENC_B_LP8 ENC_R=ENC_R8 P5V0_ENC=P5V0_ENC8

### Layout directives
net class PWR: P5V0_ENC1

### Notes on the sheet
- Labels drawn without touching a wire or pin: GND
- Project/Equipment
- Document
- Designer
- Drawn by
- Check.by
- Copyright WUT ISE 2020.
  This documentation describes Open Hardware and is licensed under the CERN OHL v.1.2. You may redistribute and modify this documentation under the terms of the CERN OHL v.1.2. (http://ohwr.org/CERNOHL). This documentation is distributed WITHOUT ANY EXPRESS OR IMPLIED WARRANTY, INCLUDING OF MERCHANTABILITY, SATISFACTORY QUALITY AND FITNESS FOR A PARTICULAR PURPOSE. Please see the CERN OHL v.1.2 for applicable conditions.
- Contact
- File
- Last Mod.
- Print Date
- Sheet
- Size
- A3
- of
- Rev
- (in symbol TL331IDBVT) V+; V-

### Library data of the parts
C51 C54 = CC0402_1PF_50V_0.25PF_C0G: Non-polarised capacitor; Part Description: SMD Multilayer Chip Ceramic Capacitor; Manufacturer: GENERIC; Manufacturer1 Part Number: C0402C109C5GACTU; Voltage: 50V; TC: C0G/NP0; Tolerance: ±0.25pF; Part Number: CC0402_1PF_50V_0.25PF_C0G; Component Kind: Standard; Component Type: Standard; Pin Count: 2; Value: 1pF; Status: Preferred; Manufacturer Part Number: CC0402_1PF_50V_0.25PF_C0G; Case: 0402; Mounted: Yes; Socket: No; SMD: Yes; Sense: No; Manufacturer1 Example: KEMET; Manufacturer1 ComponentHeight: 0.55mm; HelpURL: \\cern.ch\dfs\Applications\Altium\Datasheets\CC0402_C0G_KEMET_(Commercial Grade).pdf; Author: CERN DEM JLC; CreateDate: 03/12/2007; LatestRevisionDate: 22/04/2015
C55 C60 = CC0402_1NF_50V_10%_X7R: Non-polarised capacitor; Part Description: SMD Multilayer Chip Ceramic Capacitor; Manufacturer: GENERIC; Manufacturer1 Part Number: 223858715623; Voltage: 50V; TC: X7R; Tolerance: ±10%; Part Number: CC0402_1NF_50V_10%_X7R; Component Kind: Standard; Component Type: Standard; Pin Count: 2; Value: 1nF; Status: Not Recommended; Manufacturer Part Number: CC0402_1NF_50V_10%_X7R; Case: 0402; Mounted: Yes; Socket: No; SMD: Yes; Sense: No; Manufacturer1 Example: PHYCOMP; Manufacturer1 ComponentHeight: 0.55mm; HelpURL: \\cern.ch\dfs\Applications\Altium\Datasheets\CC0402_X7R_PHYCOMP.pdf; Author: CERN DEM JLC; CreateDate: 03/12/2007; LatestRevisionDate: 03/12/2007
C61 = CC0402_100NF_16V_10%_X5R: Non-polarised capacitor; Part Description: SMD Multilayer Chip Ceramic Capacitor; Manufacturer: GENERIC; Manufacturer1 Part Number: GRM155R61C104KA88D; Voltage: 16V; TC: X5R; Tolerance: ±10%; Part Number: CC0402_100NF_16V_10%_X5R; Component Kind: Standard; Component Type: Standard; Pin Count: 2; Value: 100nF; Status: None; Manufacturer Part Number: CC0402_100NF_16V_10%_X5R; Case: 0402; Mounted: Yes; Socket: No; SMD: Yes; Sense: No; Manufacturer1 Example: MURATA; Manufacturer1 ComponentHeight: 0.55mm; HelpURL: \\cern.ch\dfs\Applications\Altium\Datasheets\CC0402_X5R_MURATA_GRM.pdf; Author: CERN DEM JLC; CreateDate: 10.12.2013; LatestRevisionDate: 10.12.2013
D8 = ESD5V3U2U-03F: Dual Common Anode TVS; Part Description: 20kV ESD Ultra-Low Capacitance Uni-Directional TVS Diode Array; Manufacturer: INFINEON; Voltage: 5.3V; PressFit: No; Bonding: No; Part Number: ESD5V3U2U-03F; Component Kind: Standard; Component Type: Standard; Device: ESD5V3U2U-03F; PackageDescription: SOTFL, 0.40mm, Pitch; 3 Pin, 0.80mm W X 1.20mm L X 0.59mm H body, IPC Medium Density; Manufacturer Part Number: ESD5V3U2U-03F; Pin Count: 3; Case: SOTFL3; Mounted: Yes; Socket: No; SMD: Yes; Sense: No; ComponentHeight: 0.59mm; HelpURL: \\cern.ch\dfs\Applications\Altium\Datasheets\ESD5V3U2U-03F.pdf; Author: CERN DEM JLC; CreateDate: 13/03/2012; LatestRevisionDate: 13/03/2012
IC17 = TL331IDBVT: Single Voltage Comparator; Part Description: Single Differential Comparator; Manufacturer: TEXAS INSTRUMENTS; PressFit: No; Bonding: No; Part Number: TL331IDBVT; Component Kind: Standard; Component Type: Standard; Device: TL331IDBVT; PackageDescription: SOT, 0.95mm Pitch; 5 Pin, 1.60mm W X 2.90mm L X 1.45mm H body, IPC Medium Density; Manufacturer Part Number: TL331IDBVT; Pin Count: 5; Case: SOT23-5; Mounted: Yes; Socket: No; SMD: Yes; Sense: No; ComponentHeight: 1.45mm; Author: CERN DEM JLC; HelpURL: \\cern.ch\dfs\Applications\Altium\Datasheets\TL331IDBVT.pdf; CreateDate: 06/11/2018; LatestRevisionDate: 06/11/2018
P1 = TRIM_1T_5K_BOURNS_3314G-1-502E: Trimming Potentiometer; Part Description: Single Turn 4mm Square Trimpot® Trimming Potentiometer (Top Adjust); Manufacturer: BOURNS; Power: 0.25W; TC: ±100ppm/°C; Tolerance: ±20%; PressFit: No; Part Number: TRIM_1T_5K_BOURNS_3314G-1-502E; Component Kind: Standard; Component Type: Standard; Pin Count: 3; Value: 5k; Manufacturer Part Number: 3314G-1-502E; Case: 3314G-1; Mounted: Yes; Socket: No; SMD: Yes; Sense: No; ComponentHeight: 2.55mm; HelpURL: \\cern.ch\dfs\Applications\Altium\Datasheets\TRIM_BOURNS_3314G-1.pdf; Author: CERN DEM JLC; CreateDate: 04/03/2014; LatestRevisionDate: 04/03/2014
R77 = R1206_2R_1%_0.25W_200PPM: Resistor - 1%; Part Description: General Purpose Thick Film Chip Resistor; Manufacturer: GENERIC; Manufacturer1 Part Number: 232272462008L or RC1206FR-072RL; Power: 0.25W; TC: ±200ppm/°C; PressFit: No; Part Number: R1206_2R_1%_0.25W_200PPM; Component Kind: Standard; Component Type: Standard; Pin Count: 2; Value: 2; Status: Preferred; Tolerance: ±1%; Manufacturer Part Number: R1206_2R_1%_0.25W_200PPM; Case: 1206; Mounted: Yes; Socket: No; SMD: Yes; Manufacturer1 Example: YAGEO PHYCOMP; Manufacturer1 ComponentHeight: 0.65mm; HelpURL: \\cern.ch\dfs\Applications\Altium\Datasheets\R1206_Phycomp_RC1206.pdf; Author: CERN DEM JLC; CreateDate: 03/12/2007; LatestRevisionDate: 17/10/2012; Sense: No
R78 = R0603_100K_1%_0.1W_100PPM: Resistor - 1%; Part Description: General Purpose Thick Film Chip Resistor; Manufacturer: GENERIC; Manufacturer1 Part Number: NRC06F1003TRF; Power: 0.1W; TC: ±100ppm/°C; PressFit: No; Part Number: R0603_100K_1%_0.1W_100PPM; Component Kind: Standard; Component Type: Standard; Pin Count: 2; Value: 100k; Status: Preferred; Tolerance: ±1%; Manufacturer Part Number: R0603_100K_1%_0.1W_100PPM; Case: 0603; Mounted: Yes; Socket: No; SMD: Yes; Manufacturer1 Example: NIC COMPONENT; Manufacturer1 ComponentHeight: 0.55mm; HelpURL: \\cern.ch\dfs\Applications\Altium\Datasheets\R0603_NIC_NRC.pdf; Author: CERN DEM JLC; CreateDate: 03/12/2007; LatestRevisionDate: 13/03/2008; Sense: No
R79 = R0402_10K_1%_0.0625W_100PPM: Resistor - 1%; Part Description: General Purpose Thick Film Chip Resistor; Manufacturer: GENERIC; Manufacturer1 Part Number: 232270671003L; TC: ±100ppm/°C; PressFit: No; Part Number: R0402_10K_1%_0.0625W_100PPM; Component Kind: Standard; Component Type: Standard; Pin Count: 2; Value: 10k; Status: Not Recommended; Power: 0.0625W; Tolerance: ±1%; Manufacturer Part Number: R0402_10K_1%_0.0625W_100PPM; Case: 0402; Mounted: Yes; Socket: No; SMD: Yes; Manufacturer1 Example: YAGEO PHYCOMP; Manufacturer1 ComponentHeight: 0.4mm; HelpURL: \\cern.ch\dfs\Applications\Altium\Datasheets\R0402_Phycomp_RC0402.pdf; Author: CERN DEM JLC; CreateDate: 03/12/2007; LatestRevisionDate: 17/10/2012; Sense: No
R80 = R0603_47K_1%_0.1W_100PPM: Resistor - 1%; Part Description: General Purpose Thick Film Chip Resistor; Manufacturer: GENERIC; Manufacturer1 Part Number: NRC06F4702TRF; Power: 0.1W; TC: ±100ppm/°C; PressFit: No; Part Number: R0603_47K_1%_0.1W_100PPM; Component Kind: Standard; Component Type: Standard; Pin Count: 2; Value: 47k; Status: Preferred; Tolerance: ±1%; Manufacturer Part Number: R0603_47K_1%_0.1W_100PPM; Case: 0603; Mounted: Yes; Socket: No; SMD: Yes; Manufacturer1 Example: NIC COMPONENT; Manufacturer1 ComponentHeight: 0.55mm; HelpURL: \\cern.ch\dfs\Applications\Altium\Datasheets\R0603_NIC_NRC.pdf; Author: CERN DEM JLC; CreateDate: 03/12/2007; LatestRevisionDate: 13/03/2008; Sense: No
R81 R82 = R0402_1K_1%_0.0625W_100PPM: Resistor - 1%; Part Description: General Purpose Thick Film Chip Resistor; Manufacturer: GENERIC; Manufacturer1 Part Number: 232270671002L; TC: ±100ppm/°C; PressFit: No; Part Number: R0402_1K_1%_0.0625W_100PPM; Component Kind: Standard; Component Type: Standard; Pin Count: 2; Value: 1k; Status: Not Recommended; Power: 0.0625W; Tolerance: ±1%; Manufacturer Part Number: R0402_1K_1%_0.0625W_100PPM; Case: 0402; Mounted: Yes; Socket: No; SMD: Yes; Manufacturer1 Example: YAGEO PHYCOMP; Manufacturer1 ComponentHeight: 0.4mm; HelpURL: \\cern.ch\dfs\Applications\Altium\Datasheets\R0402_Phycomp_RC0402.pdf; Author: CERN DEM JLC; CreateDate: 03/12/2007; LatestRevisionDate: 17/10/2012; Sense: No
TP22 TP24 TP25 = PLATED_HOLE0.6_PAD1.3: Single Terminal Socket; Part Description: Plated Through Hole: Hole Dia.=0.6mm Pad Dia.=1.3mm; Mounted: No; Part Number: PLATED_HOLE0.6_PAD1.3; Component Type: Standard (No BOM); Pin Count: 1; Family: Plated Hole; Socket: No; SMD: No; Sense: No; Status: None; ComponentHeight: 0mm; HelpURL: Undefined; Author: CERN DEM MR; CreateDate: 02/03/2016; LatestRevisionDate: 02/03/2016; PackageDescription: Plated Through Hole: Hole Dia.=0.6mm Pad Dia.=1.3mm

## Sheet POWER_STAGE.SchDoc: Power
size 420 x 297 mm; Author: G.Kasprowicz; CompanyName: WUT ISE; DrawnBy: G.Kasprowicz; Organization: WUT ISE; Address1: PW ISE; Address2: Nowowiejska 15/19 00-665 Warsaw; Address3: gkasprow@gmail.com; DocumentNumber: 8; Revision: 2; SheetNumber: 8; SheetTotal: 10; ModifiedBy: -; CheckedDate: -; Title2: Stage; DivGrp: WUT ISE; Designer: G.Kasprowicz; ModifiedDate: -; ProjectName: Sensor Box
Used 16 times, as channels SIN_CH1, SIN_CH2, SIN_CH3, SIN_CH4, SIN_CH5, SIN_CH6, SIN_CH7, SIN_CH8, COS_CH1, COS_CH2, COS_CH3, COS_CH4, COS_CH5, COS_CH6, COS_CH7, COS_CH8. Parts and nets are listed once, with the designators drawn on the sheet.
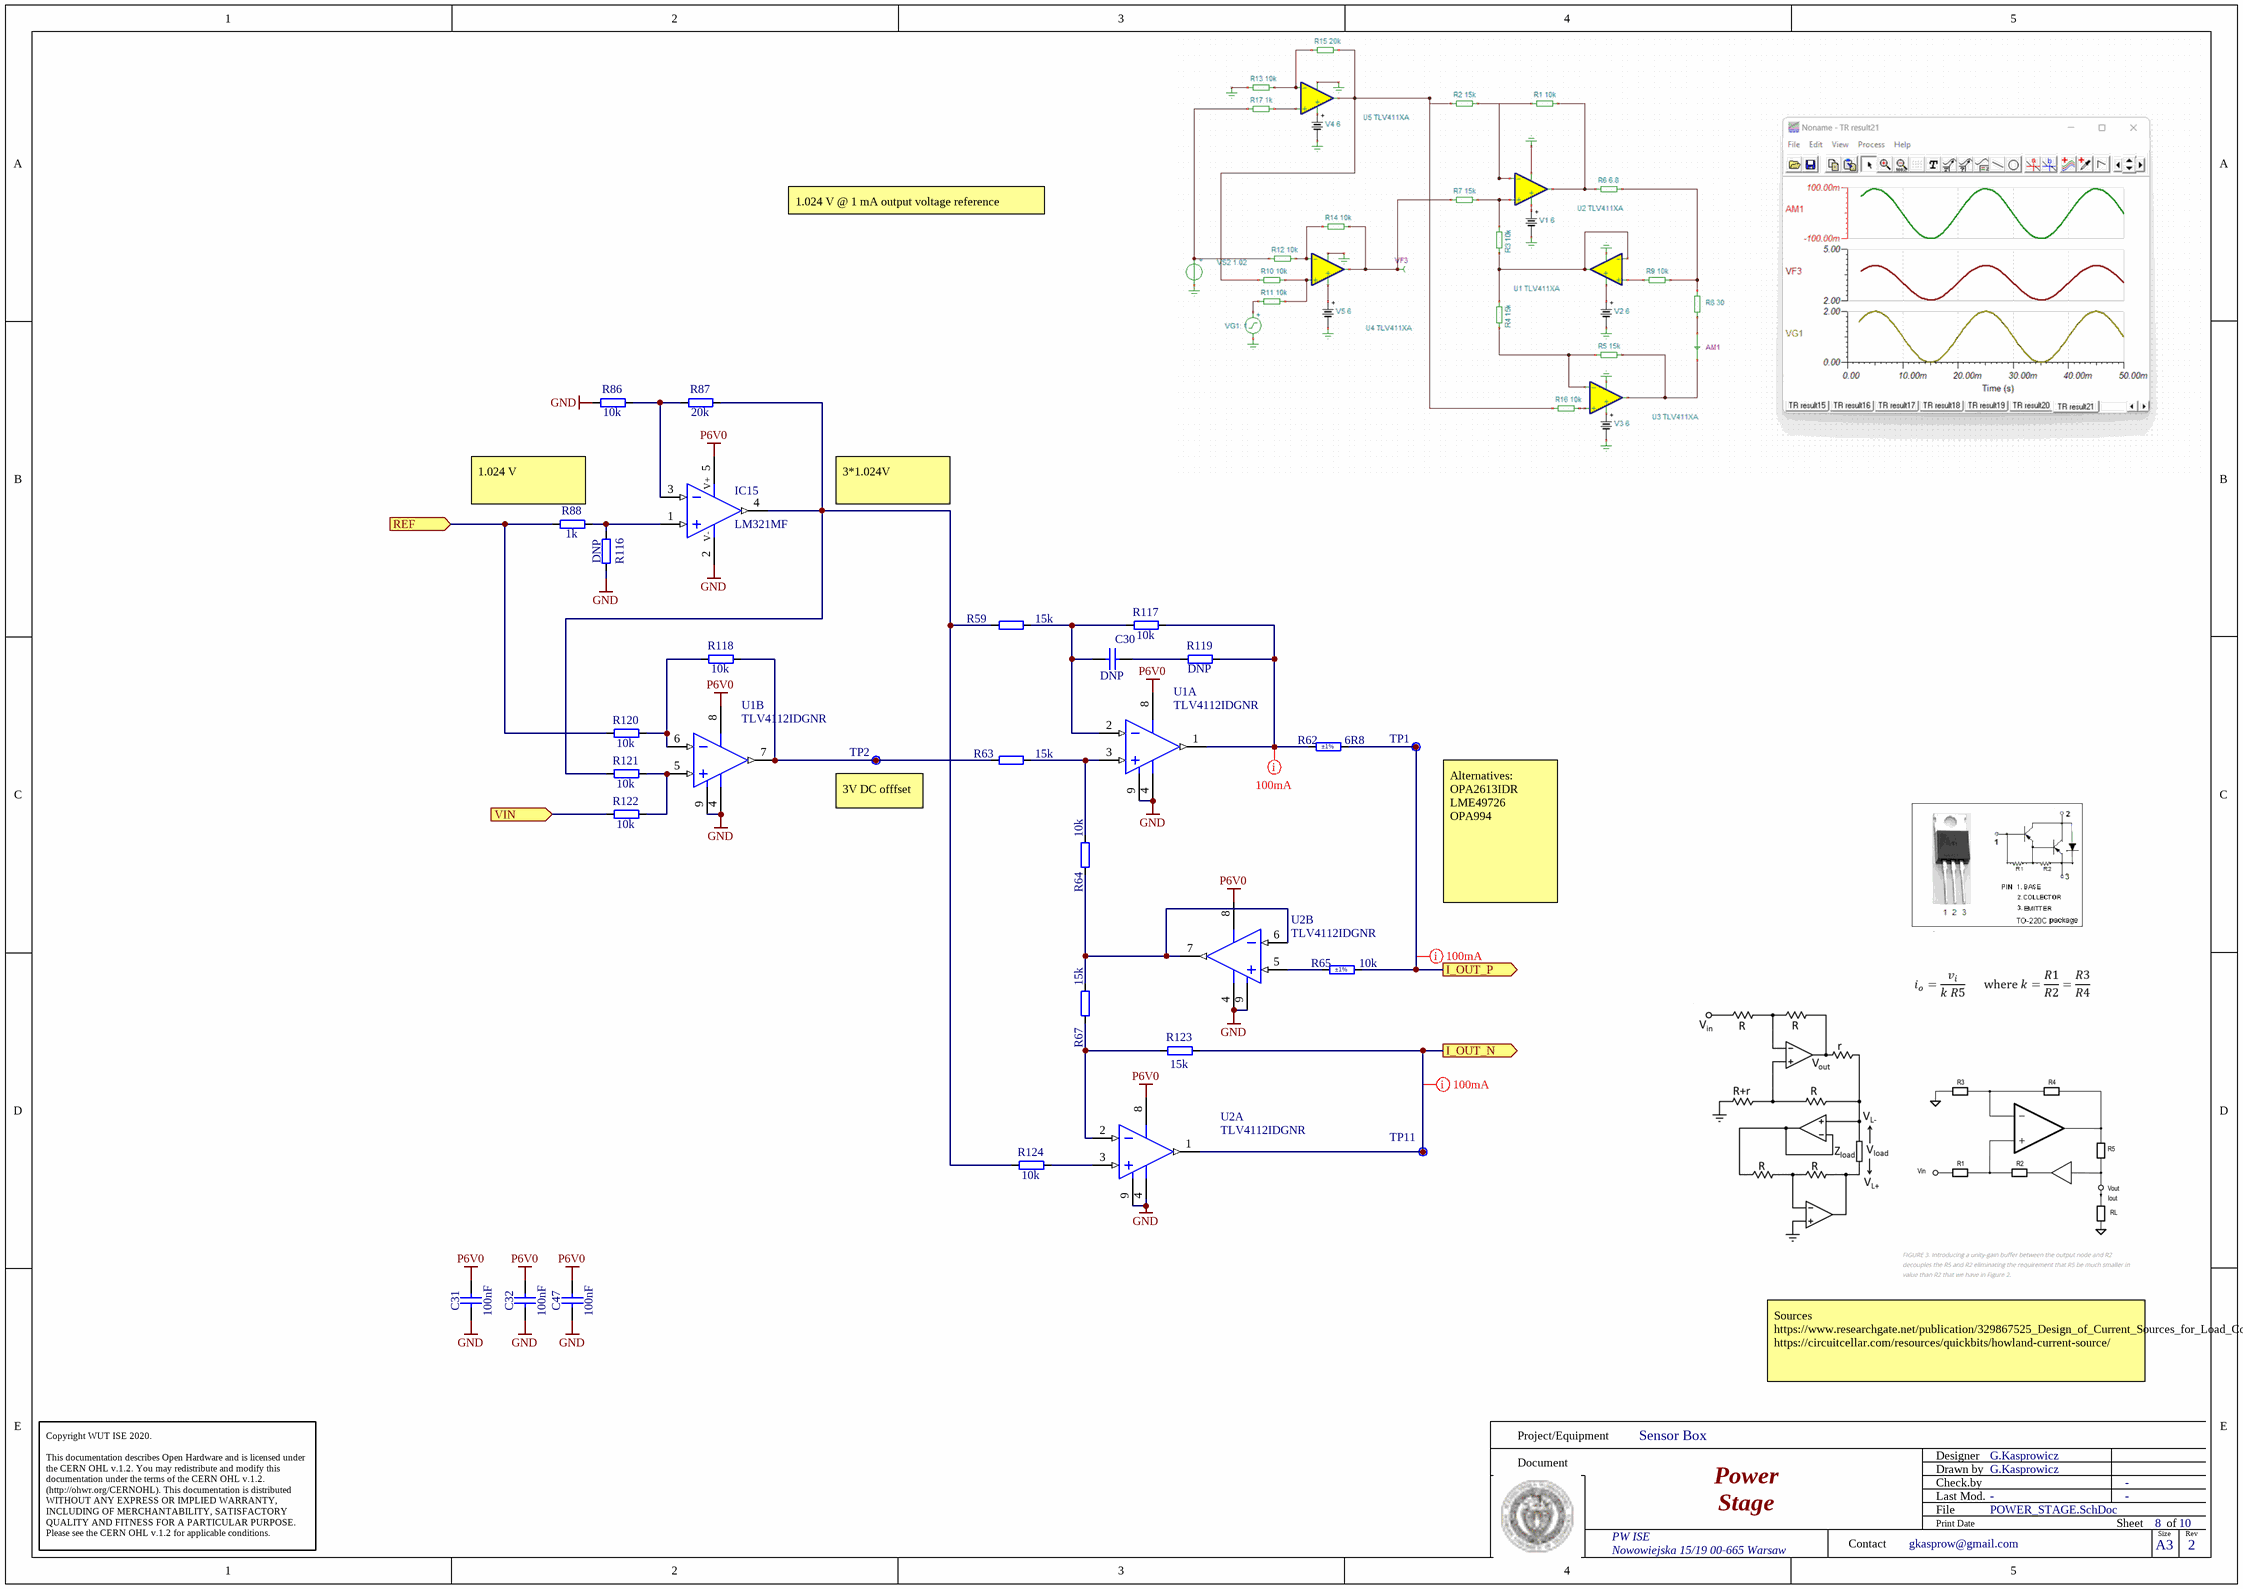
[diagram p10: POWER_STAGE.SchDoc]

### Parts
C30  DNP  [CAPC1005X55N]
C31  100nF  [CAPC1005X55N]
C32  100nF  [CAPC1005X55N]
C47  100nF  [CAPC1005X55N]
IC15  LM321MF  [SOT95P280X145-5N]
R59  15k  [RESC1005X40N]
R62  6R8  Tolerance: ±1%  [RESC6331X70N]
R63  15k  [RESC1005X40N]
R64  10k  [RESC1005X40N]
R65  10k  Tolerance: ±1%  [RESC1005X40N]
R67  15k  [RESC1005X40N]
R86  10k  [RESC1005X40N]
R87  20k  [RESC1005X40N]
R88  1k  [RESC1005X40N]
R116  DNP  [RESC1005X40N]
R117  10k  [RESC1005X40N]
R118  10k  [RESC1005X40N]
R119  DNP  [RESC1005X40N]
R120  10k  [RESC1005X40N]
R121  10k  [RESC1005X40N]
R122  10k  [RESC1005X40N]
R123  15k  [RESC1005X40N]
R124  10k  [RESC1005X40N]
TP1  Plated Hole  [c130h60]  (value not drawn)  (no BOM)
TP2  Plated Hole  [c130h60]  (value not drawn)  (no BOM)
TP11  Plated Hole  [c130h60]  (value not drawn)  (no BOM)
U1  TLV4112IDGNR  [DGN0008D_N]  (parts A,B of 2)
U2  TLV4112IDGNR  [DGN0008D_N]  (parts A,B of 2)

### Ports
I_OUT_N (out), I_OUT_P (out), REF (in), VIN (in)

### Nets
GND: C31.1 C32.1 C47.1 IC15.2(V-) R86.1 R116.2 U1.4(GND) U1.9(EP) U2.4(GND) U2.9(EP)
P6V0: C31.2 C32.2 C47.2 IC15.5(V+) U1.8(VDD+) U2.8(VDD+)
I_OUT_N: R123.2 TP11.1 U2.1(OUT1) ; port I_OUT_N
I_OUT_P: R62.2 R65.2 TP1.1 ; port I_OUT_P
REF: R88.1 R120.1 ; port REF
VIN: R122.1 ; port VIN
NetC30_1: C30.1 R59.2 R117.1 U1.2(IN1-)
NetC30_2: C30.2 R119.1
NetIC15_1: IC15.1(IN+) R88.2 R116.1
NetIC15_3: IC15.3(IN-) R86.2 R87.1
NetIC15_4: IC15.4(OUT) R59.1 R87.2 R121.1 R124.1
NetR62_1: R62.1 R117.2 R119.2 U1.1(OUT1)
NetR63_1: R63.1 R118.2 TP2.1 U1.7(OUT2)
NetR63_2: R63.2 R64.1 U1.3(IN1+)
NetR64_2: R64.2 R67.2 U2.6(IN2-) U2.7(OUT2)
NetR65_1: R65.1 U2.5(IN2+)
NetR67_1: R67.1 R123.1 U2.2(IN1-)
NetR118_1: R118.1 R120.2 U1.6(IN2-)
NetR121_2: R121.2 R122.2 U1.5(IN2+)
NetR124_2: R124.2 U2.3(IN1+)

### Channels
SIN_CH1: designators end in A; ports I_OUT_N=I_OUT_A_N1 I_OUT_P=I_OUT_A_P1 REF=DAC_REF1 VIN=DAC_OUTA1
SIN_CH2: designators end in B; ports I_OUT_N=I_OUT_A_N2 I_OUT_P=I_OUT_A_P2 REF=DAC_REF2 VIN=DAC_OUTA2
SIN_CH3: designators end in C; ports I_OUT_N=I_OUT_A_N3 I_OUT_P=I_OUT_A_P3 REF=DAC_REF3 VIN=DAC_OUTA3
SIN_CH4: designators end in D; ports I_OUT_N=I_OUT_A_N4 I_OUT_P=I_OUT_A_P4 REF=DAC_REF4 VIN=DAC_OUTA4
SIN_CH5: designators end in E; ports I_OUT_N=I_OUT_A_N5 I_OUT_P=I_OUT_A_P5 REF=DAC_REF5 VIN=DAC_OUTA5
SIN_CH6: designators end in F; ports I_OUT_N=I_OUT_A_N6 I_OUT_P=I_OUT_A_P6 REF=DAC_REF6 VIN=DAC_OUTA6
SIN_CH7: designators end in G; ports I_OUT_N=I_OUT_A_N7 I_OUT_P=I_OUT_A_P7 REF=DAC_REF7 VIN=DAC_OUTA7
SIN_CH8: designators end in H; ports I_OUT_N=I_OUT_A_N8 I_OUT_P=I_OUT_A_P8 REF=DAC_REF8 VIN=DAC_OUTA8
COS_CH1: designators end in I; ports I_OUT_N=I_OUT_B_N1 I_OUT_P=I_OUT_B_P1 REF=DAC_REF1 VIN=DAC_OUTB1
COS_CH2: designators end in J; ports I_OUT_N=I_OUT_B_N2 I_OUT_P=I_OUT_B_P2 REF=DAC_REF2 VIN=DAC_OUTB2
COS_CH3: designators end in K; ports I_OUT_N=I_OUT_B_N3 I_OUT_P=I_OUT_B_P3 REF=DAC_REF3 VIN=DAC_OUTB3
COS_CH4: designators end in L; ports I_OUT_N=I_OUT_B_N4 I_OUT_P=I_OUT_B_P4 REF=DAC_REF4 VIN=DAC_OUTB4
COS_CH5: designators end in M; ports I_OUT_N=I_OUT_B_N5 I_OUT_P=I_OUT_B_P5 REF=DAC_REF5 VIN=DAC_OUTB5
COS_CH6: designators end in N; ports I_OUT_N=I_OUT_B_N6 I_OUT_P=I_OUT_B_P6 REF=DAC_REF6 VIN=DAC_OUTB6
COS_CH7: designators end in O; ports I_OUT_N=I_OUT_B_N7 I_OUT_P=I_OUT_B_P7 REF=DAC_REF7 VIN=DAC_OUTB7
COS_CH8: designators end in P; ports I_OUT_N=I_OUT_B_N8 I_OUT_P=I_OUT_B_P8 REF=DAC_REF8 VIN=DAC_OUTB8

### Layout directives
mark named 100mA: I_OUT_A_N1, I_OUT_A_P1, NetR62A_1

### Notes on the sheet
- 1.024 V @ 1 mA output voltage reference
- (near R88) 1.024 V
- 3*1.024V
- (near TP2) 3V DC offfset
- (near TP1) Alternatives:
  OPA2613IDR
  LME49726
  OPA994
- Sources https://www.researchgate.net/publication/329867525_Design_of_Current_Sources_for_Load_Common_Mode_Optimization/figures?lo=1
  https://circuitcellar.com/resources/quickbits/howland-current-source/
- Project/Equipment
- Document
- Designer
- Drawn by
- Check.by
- Copyright WUT ISE 2020.
  This documentation describes Open Hardware and is licensed under the CERN OHL v.1.2. You may redistribute and modify this documentation under the terms of the CERN OHL v.1.2. (http://ohwr.org/CERNOHL). This documentation is distributed WITHOUT ANY EXPRESS OR IMPLIED WARRANTY, INCLUDING OF MERCHANTABILITY, SATISFACTORY QUALITY AND FITNESS FOR A PARTICULAR PURPOSE. Please see the CERN OHL v.1.2 for applicable conditions.
- Contact
- File
- Last Mod.
- Print Date
- Sheet
- Size
- A3
- of
- Rev

### Library data of the parts
C30 = CC0402_100NF_16V_10%_X5R: Non-polarised capacitor; Part Description: SMD Multilayer Chip Ceramic Capacitor; Manufacturer: GENERIC; Manufacturer1 Part Number: GRM155R61C104KA88D; Value: 100nF; Voltage: 16V; TC: X5R; Tolerance: ±10%; Part Number: CC0402_100NF_16V_10%_X5R; Component Kind: Standard; Component Type: Standard; Pin Count: 2; Status: None; Manufacturer Part Number: CC0402_100NF_16V_10%_X5R; Case: 0402; Mounted: Yes; Socket: No; SMD: Yes; Sense: No; Manufacturer1 Example: MURATA; Manufacturer1 ComponentHeight: 0.55mm; HelpURL: \\cern.ch\dfs\Applications\Altium\Datasheets\CC0402_X5R_MURATA_GRM.pdf; Author: CERN DEM JLC; CreateDate: 10.12.2013; LatestRevisionDate: 10.12.2013
C31 C32 C47 = CC0402_100NF_16V_10%_X5R: as C61 on sheet ENCODER; Part Number: CC0402_100NF_16V_10%_X5R; Component Kind: Standard; Component Type: Standard; Pin Count: 2; Value: 100nF; Status: None; Manufacturer Part Number: CC0402_100NF_16V_10%_X5R; Case: 0402; Mounted: Yes; Socket: No; SMD: Yes; Sense: No; Manufacturer1 Example: MURATA; Manufacturer1 ComponentHeight: 0.55mm; HelpURL: \\cern.ch\dfs\Applications\Altium\Datasheets\CC0402_X5R_MURATA_GRM.pdf; Author: CERN DEM JLC; CreateDate: 10.12.2013; LatestRevisionDate: 10.12.2013
IC15 = LM321MF/NOPB: Low Power Single Operational Amplifier; Manufacturer: TEXAS INSTRUMENTS; PressFit: No; Bonding: No; Part Number: LM321MF/NOPB; Component Kind: Standard; Component Type: Standard; Device: LM321MF; PackageDescription: SOT, 0.95mm Pitch; 5 Pin, 1.60mm W X 2.90mm L X 1.45mm H body, IPC Medium Density; Part Description: Low Power Single Operational Amplifier; Manufacturer Part Number: LM321MF; Pin Count: 5; Case: SOT23-5; Mounted: Yes; Socket: No; SMD: Yes; Sense: No; ComponentHeight: 1.45mm; Author: CERN DEM BC; HelpURL: \\cern.ch\dfs\Applications\Altium\Datasheets\LM321MF-NOPB.pdf; CreateDate: 04/09/2015; LatestRevisionDate: 01/06/2022
R59 R63 R67 R123 = R0402_15K_1%_0.0625W_100PPM: Resistor - 1%; Part Description: General Purpose Thick Film Chip Resistor; Manufacturer: GENERIC; Manufacturer1 Part Number: CRCW040215K0FK; TC: ±100ppm/°C; PressFit: No; Part Number: R0402_15K_1%_0.0625W_100PPM; Component Kind: Standard; Component Type: Standard; Pin Count: 2; Value: 15k; Sense: No; Power: 0.0625W; Tolerance: ±1%; Manufacturer Part Number: R0402_15K_1%_0.0625W_100PPM; Case: 0402; Mounted: Yes; Socket: No; SMD: Yes; HelpURL: \\cern.ch\dfs\Applications\Altium\Datasheets\R0402_VISHAY_CRCW e3.pdf; Author: CERN DEM JMW; CreateDate: 06/07/2015; LatestRevisionDate: 06/07/2015; Status: Preferred; Manufacturer1 Example: VISHAY; Manufacturer1 ComponentHeight: 0.4mm
R62 = R2512_6R8_1%_1W_200PPM: Resistor - 1%; Part Description: Thick Film Chip Resistor; Manufacturer: GENERIC; Manufacturer1 Part Number: 232276366808L or RC2512FK-076R8L; Power: 1W; TC: ±200ppm/°C; PressFit: No; Part Number: R2512_6R8_1%_1W_200PPM; Component Kind: Standard; Component Type: Standard; Pin Count: 2; Value: 6R8; Status: Preferred; Manufacturer Part Number: R2512_6R8_1%_1W_200PPM; Case: 2512; Mounted: Yes; Sense: No; Socket: No; SMD: Yes; HelpURL: \\cern.ch\dfs\Applications\Altium\Datasheets\R2512_Phycomp_RC2512.pdf; Author: CERN DEM JLC; CreateDate: 21/07/2008; LatestRevisionDate: 17/10/2012; Manufacturer1 Example: YAGEO PHYCOMP; Manufacturer1 ComponentHeight: 0.65mm
R64 R86 R117 R118 R120-R122 R124 = R0402_10K_1%_0.0625W_100PPM: as R79 on sheet ENCODER; Part Number: R0402_10K_1%_0.0625W_100PPM; Component Kind: Standard; Component Type: Standard; Pin Count: 2; Value: 10k; Sense: No; Power: 0.0625W; Tolerance: ±1%; Manufacturer Part Number: R0402_10K_1%_0.0625W_100PPM; Case: 0402; Mounted: Yes; Socket: No; SMD: Yes; HelpURL: \\cern.ch\dfs\Applications\Altium\Datasheets\R0402_Phycomp_RC0402.pdf; Author: CERN DEM JLC; CreateDate: 03/12/2007; LatestRevisionDate: 17/10/2012; Status: Not Recommended; Manufacturer1 Example: YAGEO PHYCOMP; Manufacturer1 ComponentHeight: 0.4mm
R65 = R0402_10K_1%_0.0625W_100PPM: Resistor - 1%; Part Description: General Purpose Thick Film Chip Resistor; Manufacturer: GENERIC; Manufacturer1 Part Number: 232270671003L; PressFit: No; TC: ±100ppm/°C; Part Number: R0402_10K_1%_0.0625W_100PPM; Component Kind: Standard; Component Type: Standard; Pin Count: 2; Value: 10k; Status: Not Recommended; Manufacturer Part Number: R0402_10K_1%_0.0625W_100PPM; Case: 0402; Mounted: Yes; Sense: No; Socket: No; SMD: Yes; Manufacturer1 Example: YAGEO PHYCOMP; Manufacturer1 ComponentHeight: 0.4mm; HelpURL: \\cern.ch\dfs\Applications\Altium\Datasheets\R0402_Phycomp_RC0402.pdf; Author: CERN DEM JLC; CreateDate: 03/12/2007; LatestRevisionDate: 17/10/2012; Power: 0.0625W
R87 R88 R116 R119 = R0402_10K_1%_0.0625W_100PPM: Resistor - 1%; Part Description: General Purpose Thick Film Chip Resistor; Manufacturer: GENERIC; Manufacturer1 Part Number: 232270671003L; Value: 10k; TC: ±100ppm/°C; PressFit: No; Part Number: R0402_10K_1%_0.0625W_100PPM; Component Kind: Standard; Component Type: Standard; Pin Count: 2; Sense: No; Power: 0.0625W; Tolerance: ±1%; Manufacturer Part Number: R0402_10K_1%_0.0625W_100PPM; Case: 0402; Mounted: Yes; Socket: No; SMD: Yes; HelpURL: \\cern.ch\dfs\Applications\Altium\Datasheets\R0402_Phycomp_RC0402.pdf; Author: CERN DEM JLC; CreateDate: 03/12/2007; LatestRevisionDate: 17/10/2012; Status: Not Recommended; Manufacturer1 Example: YAGEO PHYCOMP; Manufacturer1 ComponentHeight: 0.4mm
TP1 TP2 TP11 = PLATED_HOLE0.6_PAD1.3: as TP22 on sheet ENCODER; Part Number: PLATED_HOLE0.6_PAD1.3; Component Type: Standard (No BOM); Pin Count: 1; Family: Plated Hole; Socket: No; SMD: No; Sense: No; Status: None; ComponentHeight: 0mm; HelpURL: Undefined; Author: CERN DEM MR; CreateDate: 02/03/2016; LatestRevisionDate: 02/03/2016; PackageDescription: Plated Through Hole: Hole Dia.=0.6mm Pad Dia.=1.3mm
U1 U2 = CMP-0272-01268-3: High-Output-Drive Operational Amplifier, 2.5 to 6 V, -40 to 125 degC, 8-pin SOP (DGN8), Green (RoHS & no Sb/Br); Manufacturer: Texas Instruments; Total Supply Voltage(Min)(+5V is 5, +/-5V is 10): 2.5; Total Supply Voltage(Max)(+5V is 5, +/-5V is 10): 6; Offset Drift(Typ)(uV/C): 3; Sub Family: Low Supply Voltage Amplifier (<=2.7V), Precision Amplifier; Vio (25C)(Max)(mV): 3.5; Iq per channel(Max)(mA): 1; IIB(Max)(pA): 50; Slew Rate(Typ)(V/us): 1.57; Number of Channels: 2; CMRR(Min)(dB): 63; Vn at 1kHz(Typ)(nV/rtHz): 20; Eco-Plan: Green (RoHS & no Sb/Br); ComponentLink2URL: http://www.ti.com/general/docs/lit/getliterature.tsp?genericPartNumber=TLV4112&fileType=pdf; PartNumber: TLV4112IDGNR; PackageReference: DGN0008D; DatasheetVersion: SLOS289E; ComponentLink3Description: Package Specification; Code_JEDEC: MO-187; ComponentLink1Description: Manufacturer URL; ComponentLink1URL: http://www.ti.com/; PackageDescription: 8-Pin Plastic Small Outline, Body 3 x 3 mm, Pitch 0.65 mm; ComponentLink3URL: http://www.ti.com/litv/pdf/mpds046e; ComponentLink2Description: Datasheet; PackageVersion: 4073271/F, 05/2011; Mounting Technology: Surface Mount